# EAGLE design rub-20-datalogger-schaltplan (EAGLE 9.5.2)

## Sheet 1 of 6
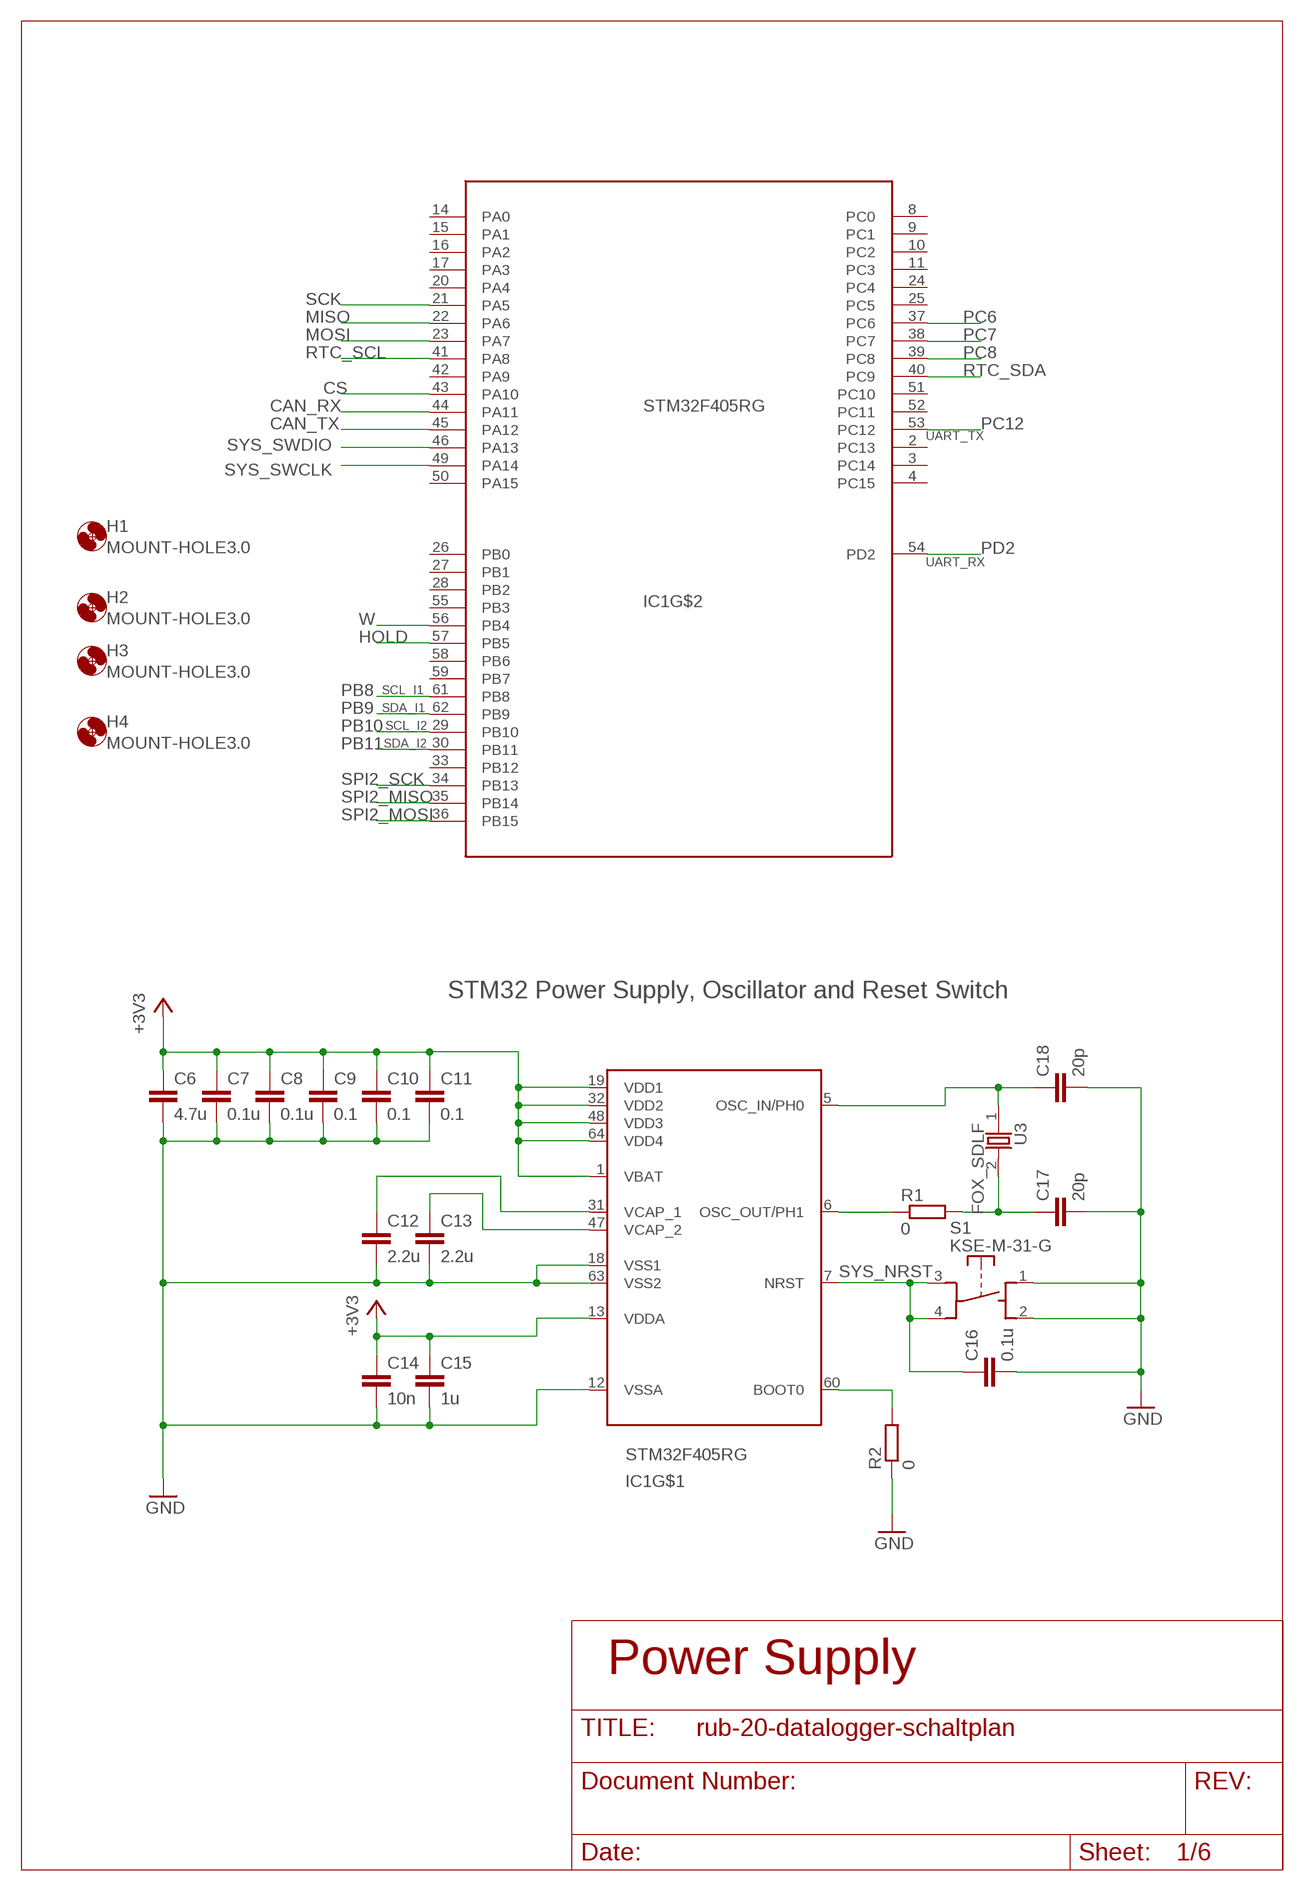
[diagram p0: schematic, sheet 1]

### Parts
C6  4.7u  C-EUC0805  [C0805]
C7  0.1u  C-EUC0805  [C0805]
C8  0.1u  C-EUC0805  [C0805]
C9  0.1  C-EUC0805  [C0805]
C10  0.1  C-EUC0805  [C0805]
C11  0.1  C-EUC0805  [C0805]
C12  2.2u  C-EUC0805  [C0805]
C13  2.2u  C-EUC0805  [C0805]
C14  10n  C-EUC0805  [C0805]
C15  1u  C-EUC0805  [C0805]
C16  0.1u  C-EUC0805  [C0805]
C17  20p  C-EUC0805  [C0805]
C18  20p  C-EUC0805  [C0805]
H1  MOUNT-HOLE3.0  [3,0]
H2  MOUNT-HOLE3.0  [3,0]
H3  MOUNT-HOLE3.0  [3,0]
H4  MOUNT-HOLE3.0  [3,0]
IC1  STM32F405RG  [LQFP64]
R1  0  R-EU_R0805  [R0805]
R2  0  R-EU_R0805  [R0805]
S1  KSE-M-31-G  [KSE-M-31-G]
U3  FOX_SDLF  [HC49SSDLF]

### Nets
+3V3: C6.1 C7.1 C8.1 C9.1 C10.1 C11.1 C14.1 C15.1 IC1.1(VBAT) IC1.13(VDDA) IC1.19(VDD1) IC1.32(VDD2) IC1.48(VDD3) IC1.64(VDD4) ; also sheet 2,3,4,5,6
CAN_RX: IC1.44(PA11) ; also sheet 2
CAN_TX: IC1.45(PA12) ; also sheet 2
CS: IC1.43(PA10) ; also sheet 5
GND: C6.2 C7.2 C8.2 C9.2 C10.2 C11.2 C12.2 C13.2 C14.2 C15.2 C16.2 C17.2 C18.2 IC1.12(VSSA) IC1.18(VSS1) IC1.63(VSS2) R2.1 S1.1 S1.2 ; also sheet 2,3,4,5,6
HOLD: IC1.57(PB5) ; also sheet 4
MISO: IC1.22(PA6) ; also sheet 5
MOSI: IC1.23(PA7) ; also sheet 5
N$1: C13.1 IC1.47(VCAP_2)
N$2: C12.1 IC1.31(VCAP_1)
N$3: IC1.60(BOOT0) R2.2
N$4: IC1.6(OSC_OUT/PH1) R1.1
N$5: C17.1 R1.2 U3.2
N$6: C18.1 IC1.5(OSC_IN/PH0) U3.1
PB8: IC1.61(PB8) ; also sheet 4
PB9: IC1.62(PB9) ; also sheet 4
PB10: IC1.29(PB10) ; also sheet 4
PB11: IC1.30(PB11) ; also sheet 4
PC6: IC1.37(PC6) ; also sheet 3
PC7: IC1.38(PC7) ; also sheet 3
PC8: IC1.39(PC8) ; also sheet 3
PC12: IC1.53(PC12) ; also sheet 3
PD2: IC1.54(PD2) ; also sheet 3
RTC_SCL: IC1.41(PA8) ; also sheet 6
RTC_SDA: IC1.40(PC9) ; also sheet 6
SCK: IC1.21(PA5) ; also sheet 5
SPI2_MISO: IC1.35(PB14) ; also sheet 4
SPI2_MOSI: IC1.36(PB15) ; also sheet 4
SPI2_SCK: IC1.34(PB13) ; also sheet 4
SYS_NRST: C16.1 IC1.7(NRST) S1.3 S1.4 ; also sheet 2
SYS_SWCLK: IC1.49(PA14) ; also sheet 2
SYS_SWDIO: IC1.46(PA13) ; also sheet 2
W: IC1.56(PB4) ; also sheet 4
Unconnected: IC1.2(PC13) IC1.3(PC14) IC1.4(PC15) IC1.8(PC0) IC1.9(PC1) IC1.10(PC2) IC1.11(PC3) IC1.14(PA0) IC1.15(PA1) IC1.16(PA2) IC1.17(PA3) IC1.20(PA4) IC1.24(PC4) IC1.25(PC5) IC1.26(PB0) IC1.27(PB1) IC1.28(PB2) IC1.33(PB12) IC1.42(PA9) IC1.50(PA15) IC1.51(PC10) IC1.52(PC11) IC1.55(PB3) IC1.58(PB6) IC1.59(PB7)

### Notes on the sheet
- UART_TX
- UART_RX
- SCL_I1
- SDA_I1
- SCL_I2
- SDA_I2
- STM32 Power Supply, Oscillator and Reset Switch
- Power Supply

## Sheet 2 of 6
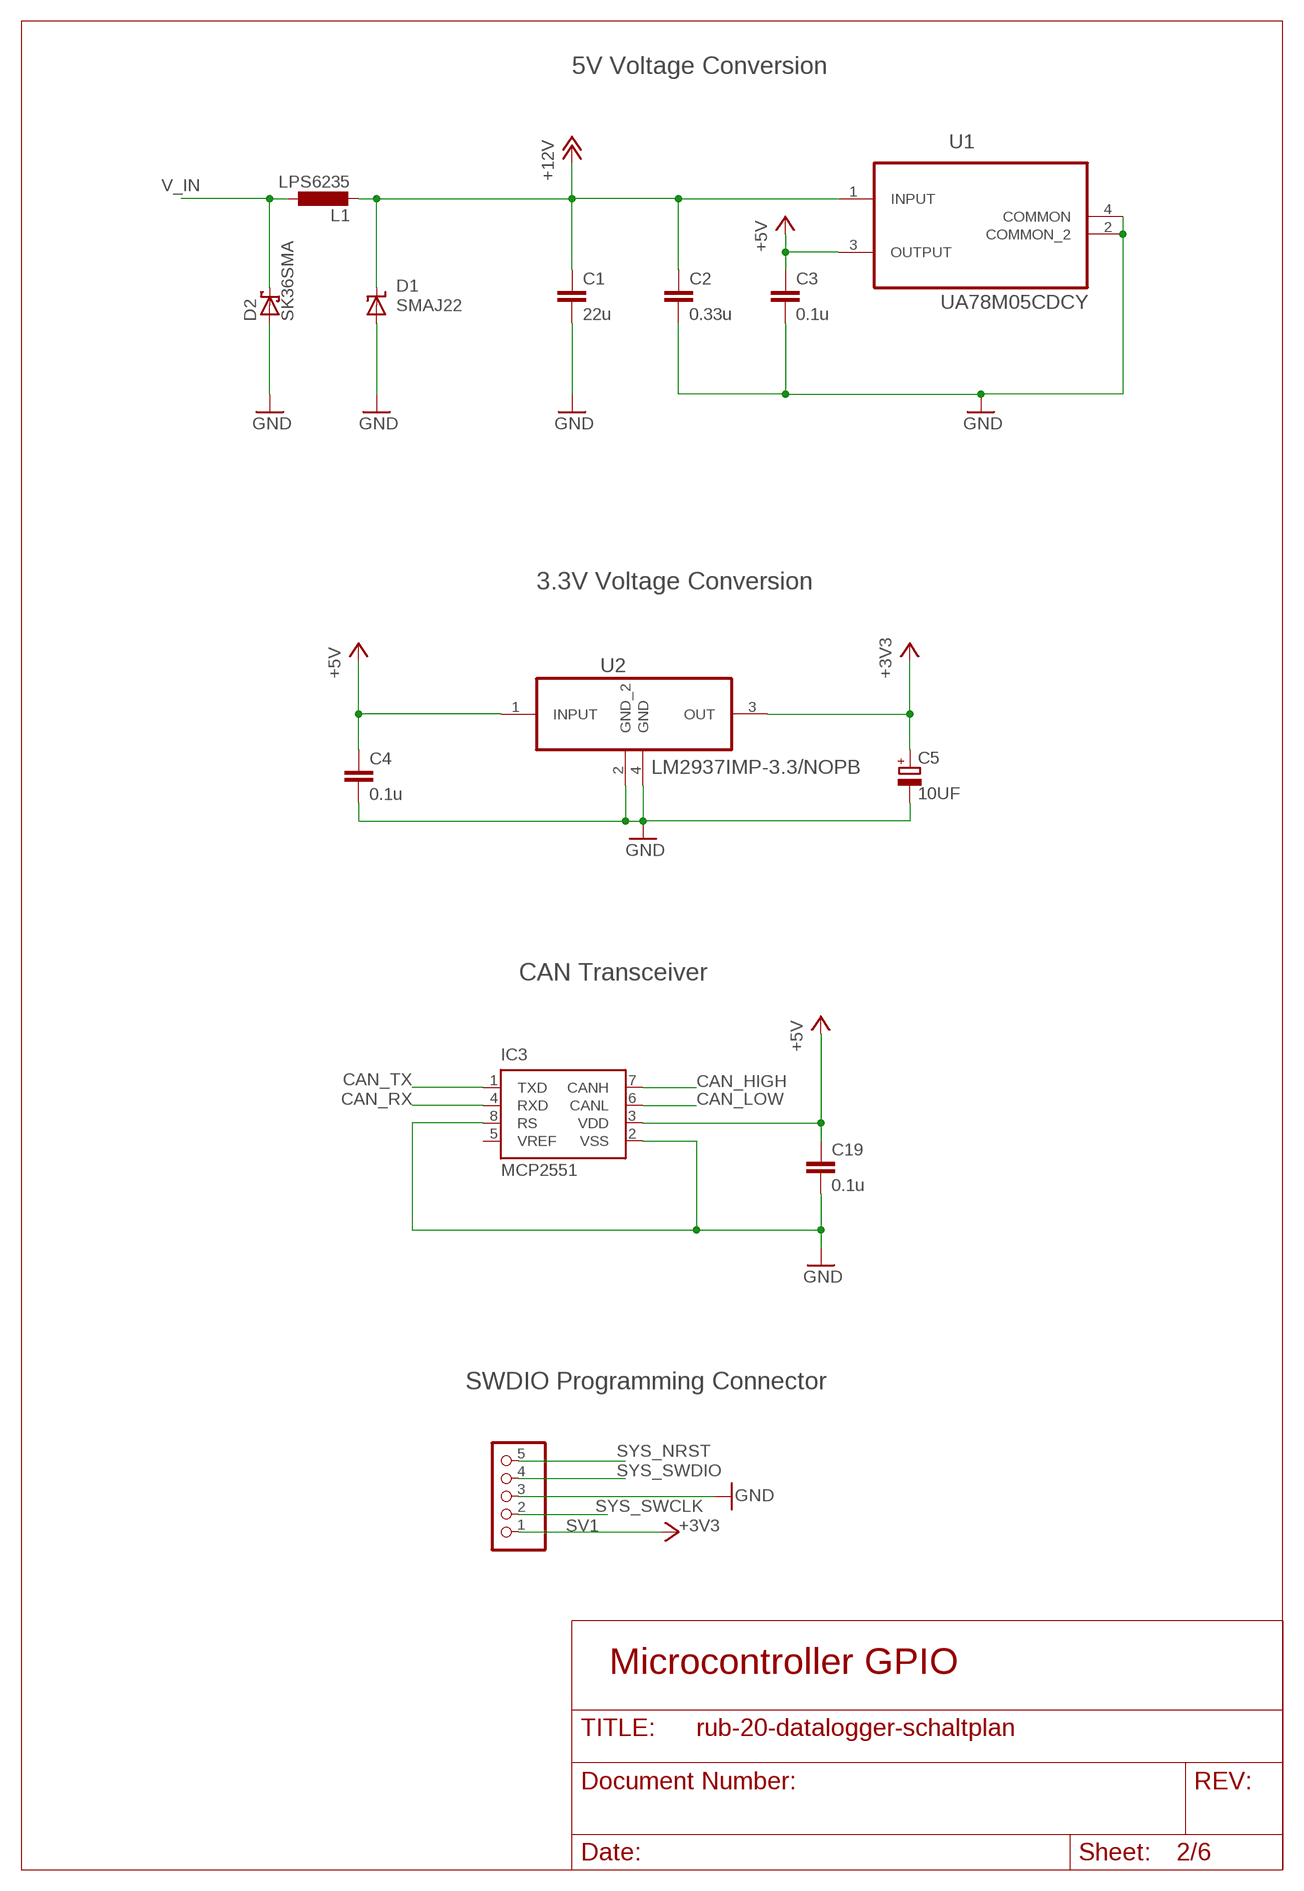
[diagram p1: schematic, sheet 2]

### Parts
C1  22u  C-EUC1812K  [C1812K]
C2  0.33u  C-EUC0805  [C0805]
C3  0.1u  C-EUC0805  [C0805]
C4  0.1u  C-EUC0805  [C0805]
C5  10UF  EEE-FK1C100AR-CASE-B  [CAPAE430X610N]
C19  0.1u  C-EUC0805  [C0805]
D1  SMAJ22  [SMA-DO214AC]
D2  SK36SMA  [DO214AC]
IC3  MCP2551  [8SO]
L1  LPS6235  [LPS6235]
SV1  PINHD-1X5  [1X05]
U1  UA78M05CDCY  [SOT230P700X180-4N]
U2  LM2937IMP-3.3/NOPB  [SOT230P700X180-4N]

### Nets
+3V3: C5.1(+) SV1.1 U2.3(OUT) ; also sheet 1,3,4,5,6
+5V: C3.1 C4.1 C19.1 IC3.3(VDD) U1.3(OUTPUT) U2.1(INPUT) ; also sheet 3,4
+12V: C1.1 C2.1 D1.K(C) L1.2 U1.1(INPUT) ; also sheet 3
CAN_HIGH: IC3.7(CANH) ; also sheet 3
CAN_LOW: IC3.6(CANL) ; also sheet 3
CAN_RX: IC3.4(RXD) ; also sheet 1
CAN_TX: IC3.1(TXD) ; also sheet 1
GND: C1.2 C2.2 C3.2 C4.2 C5.2(-) C19.2 D1.A D2.A IC3.2(VSS) IC3.8(RS) SV1.3 U1.2(COMMON_2) U1.4(COMMON) U2.2(GND_2) U2.4(GND) ; also sheet 1,3,4,5,6
SYS_NRST: SV1.5 ; also sheet 1
SYS_SWCLK: SV1.2 ; also sheet 1
SYS_SWDIO: SV1.4 ; also sheet 1
V_IN: D2.C L1.1 ; also sheet 3
Unconnected: IC3.5(VREF)

### Notes on the sheet
- 5V Voltage Conversion
- 3.3V Voltage Conversion
- CAN Transceiver
- SWDIO Programming Connector
- Microcontroller GPIO

## Sheet 3 of 6
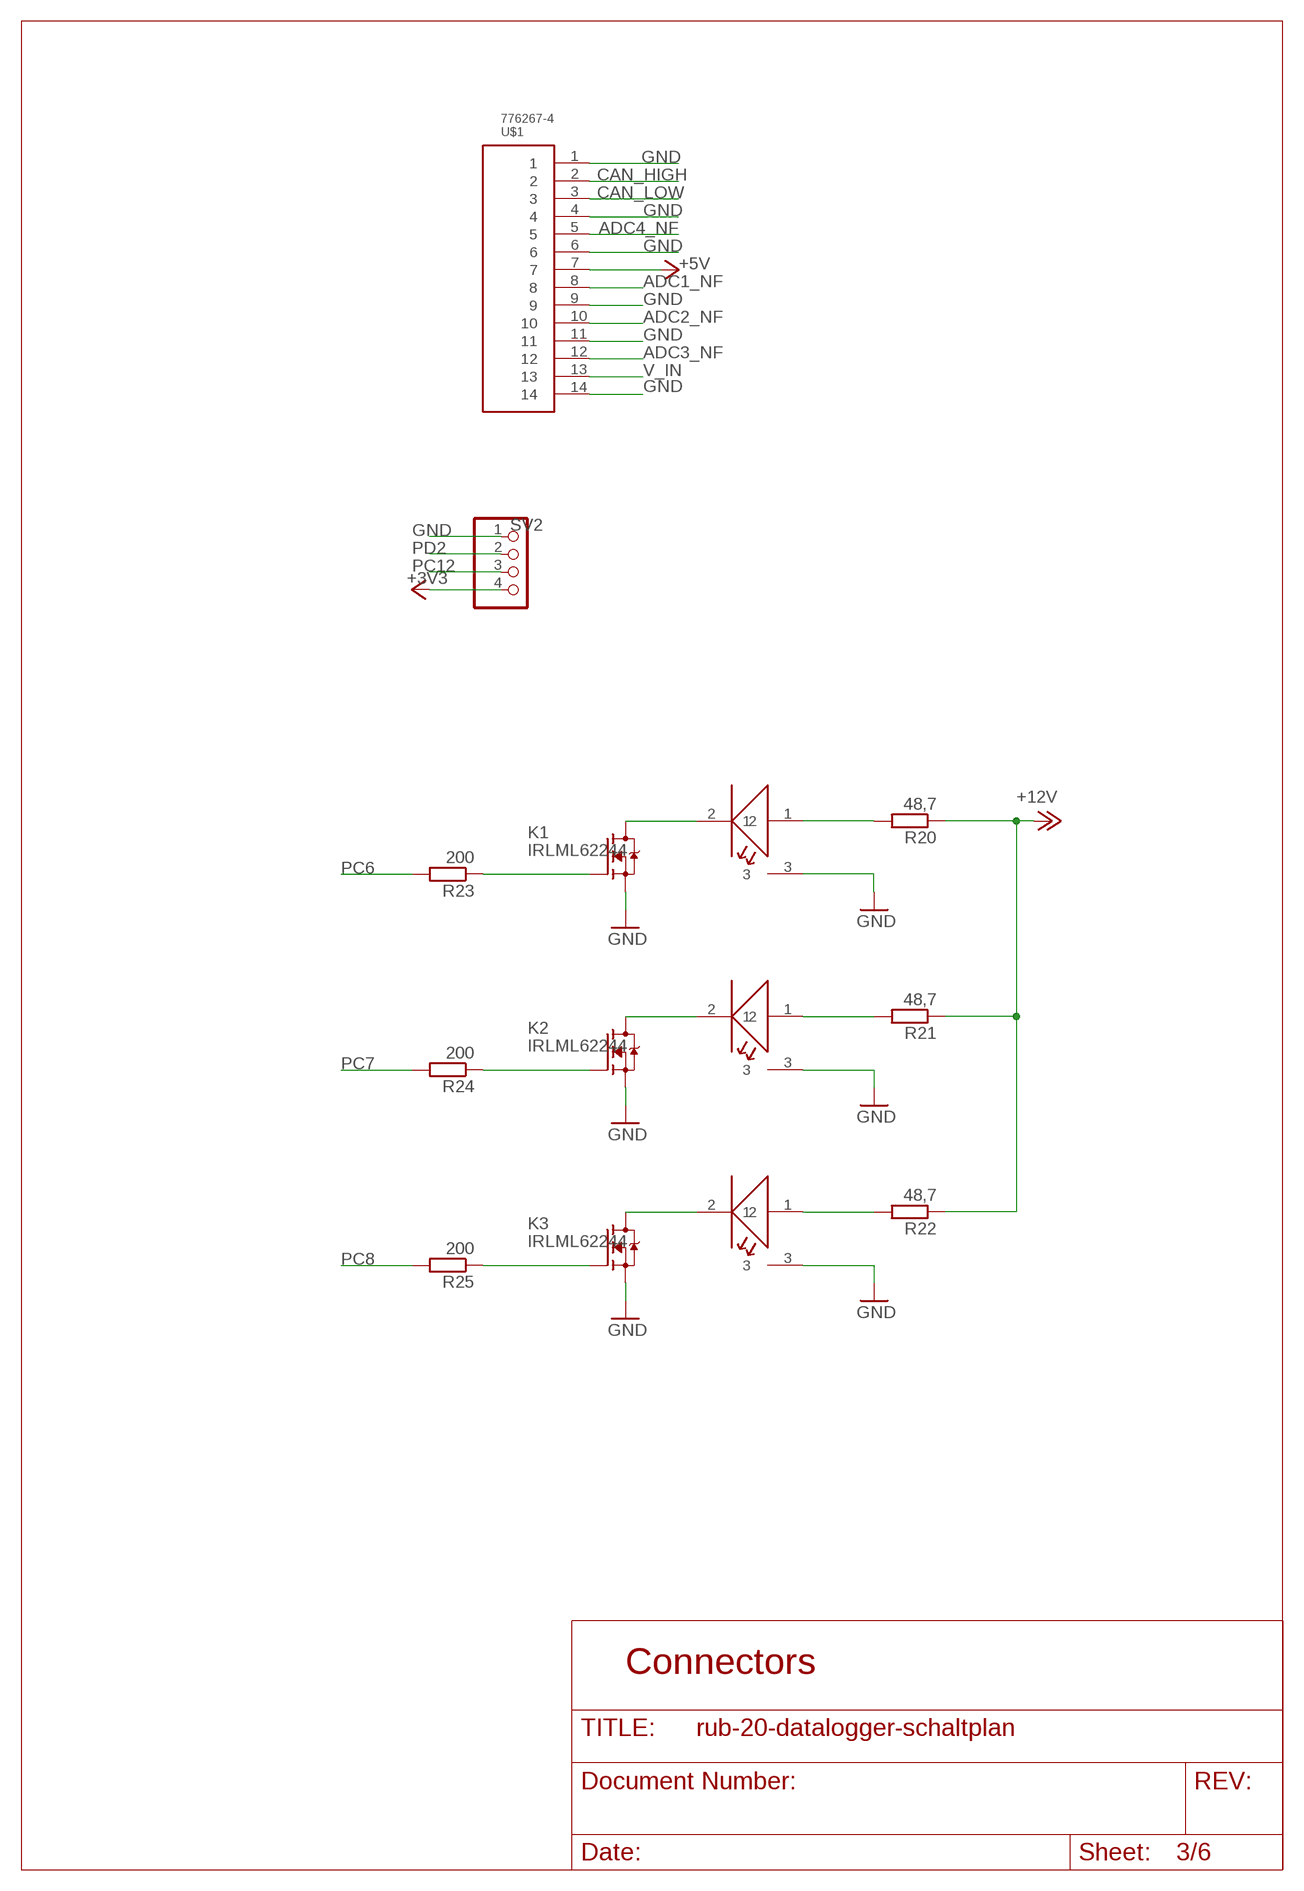
[diagram p2: schematic, sheet 3]

### Parts
K1  IRLML62244  [SOT23-MICRO]
K2  IRLML62244  [SOT23-MICRO]
K3  IRLML62244  [SOT23-MICRO]
P1  XLAMP_ML-E  [CREE_XLAMP_ML-E]
P2  XLAMP_ML-E  [CREE_XLAMP_ML-E]
P3  XLAMP_ML-E  [CREE_XLAMP_ML-E]
R20  48,7  R-EU_R0805  [R0805]
R21  48,7  R-EU_R0805  [R0805]
R22  48,7  R-EU_R0805  [R0805]
R23  200  R-EU_R0805  [R0805]
R24  200  R-EU_R0805  [R0805]
R25  200  R-EU_R0805  [R0805]
SV2  PINHD-1X4  [1X04]
U$1  776267-4  [TE_776267-4]

### Nets
+3V3: SV2.4 ; also sheet 1,2,4,5,6
+5V: U$1.7 ; also sheet 2,4
+12V: R20.1 R21.1 R22.1 ; also sheet 2
ADC1_NF: U$1.8 ; also sheet 4
ADC2_NF: U$1.10 ; also sheet 4
ADC3_NF: U$1.12 ; also sheet 4
ADC4_NF: U$1.5 ; also sheet 4
CAN_HIGH: U$1.2 ; also sheet 2
CAN_LOW: U$1.3 ; also sheet 2
GND: K1.2(S) K2.2(S) K3.2(S) P1.3 P2.3 P3.3 SV2.1 U$1.1 U$1.4 U$1.6 U$1.9 U$1.11 U$1.14 ; also sheet 1,2,4,5,6
N$22: P2.1 R21.2
N$23: P1.1 R20.2
N$24: P3.1 R22.2
N$28: K1.1(G) R23.1
N$29: K2.1(G) R24.1
N$30: K3.1(G) R25.1
N$31: K1.3(D) P1.2
N$32: K2.3(D) P2.2
N$33: K3.3(D) P3.2
PC6: R23.2 ; also sheet 1
PC7: R24.2 ; also sheet 1
PC8: R25.2 ; also sheet 1
PC12: SV2.3 ; also sheet 1
PD2: SV2.2 ; also sheet 1
V_IN: U$1.13 ; also sheet 2

### Notes on the sheet
- Connectors

## Sheet 4 of 6
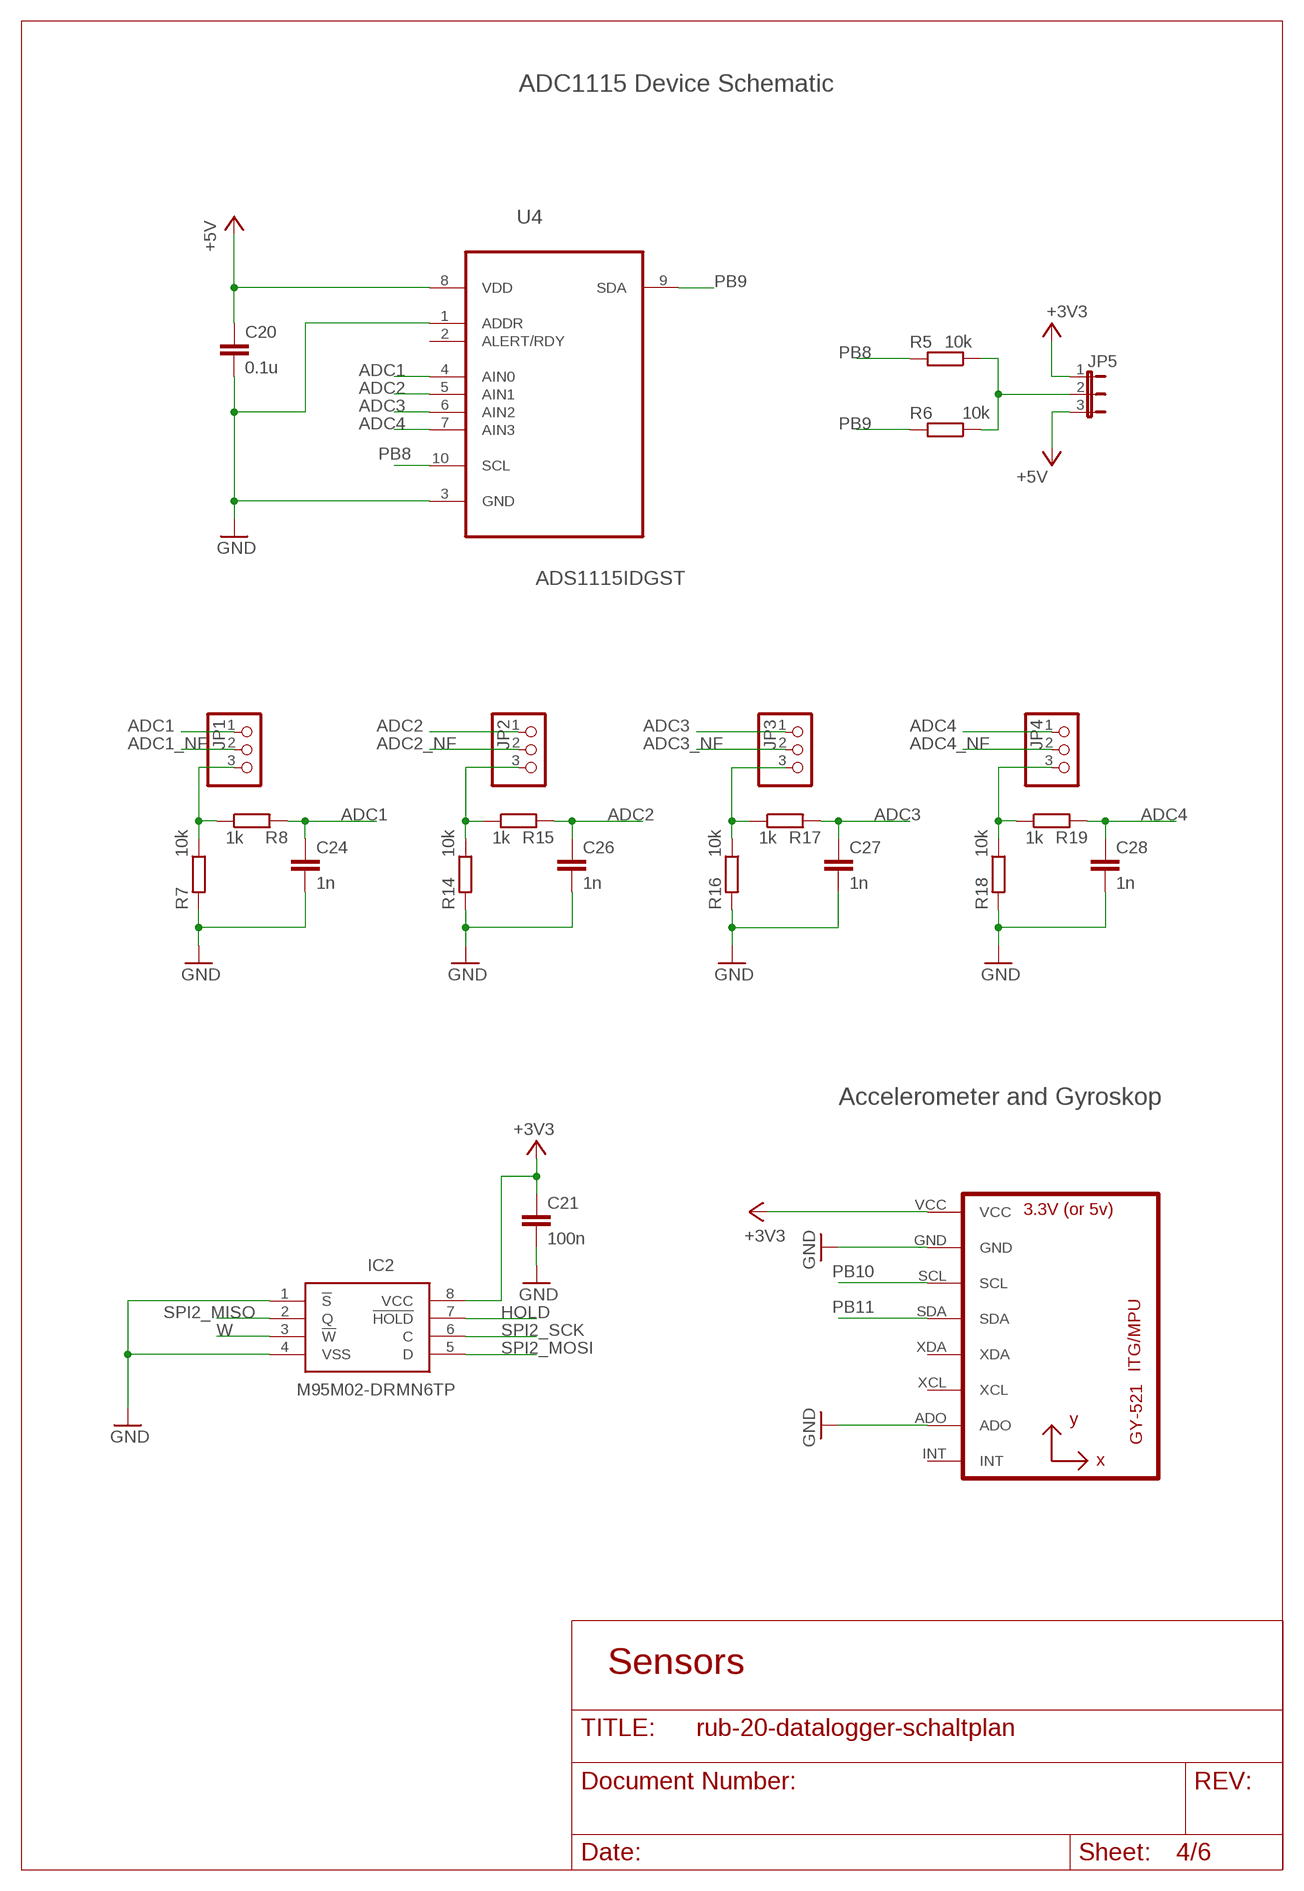
[diagram p3: schematic, sheet 4]

### Parts
C20  0.1u  C-EUC0805  [C0805]
C21  100n  C-EUC0805  [C0805]
C24  1n  C-EUC0805  [C0805]
C26  1n  C-EUC0805  [C0805]
C27  1n  C-EUC0805  [C0805]
C28  1n  C-EUC0805  [C0805]
IC2  M95M02-DRMN6TP  [SOIC127P600X175-8N]
JP1  PINHD-1X3  [1X03]
JP2  PINHD-1X3  [1X03]
JP3  PINHD-1X3  [1X03]
JP4  PINHD-1X3  [1X03]
JP5  JP2E  [JP2]
R5  10k  R-EU_R0805  [R0805]
R6  10k  R-EU_R0805  [R0805]
R7  10k  R-EU_R0805  [R0805]
R8  1k  R-EU_R0805  [R0805]
R14  10k  R-EU_R0805  [R0805]
R15  1k  R-EU_R0805  [R0805]
R16  10k  R-EU_R0805  [R0805]
R17  1k  R-EU_R0805  [R0805]
R18  10k  R-EU_R0805  [R0805]
R19  1k  R-EU_R0805  [R0805]
U4  ADS1115IDGST  [SOP50P490X110-10N]
U6  GY-521MPU6050  [GY-521]

### Nets
+3V3: C21.1 IC2.8(VCC) JP5.1 U6.VCC ; also sheet 1,2,3,5,6
+5V: C20.1 JP5.3 U4.8(VDD) ; also sheet 2,3
ADC1: C24.1 JP1.1 R8.2 U4.4(AIN0)
ADC1_NF: JP1.2 ; also sheet 3
ADC2: C26.1 JP2.1 R15.2 U4.5(AIN1)
ADC2_NF: JP2.2 ; also sheet 3
ADC3: C27.1 JP3.1 R17.2 U4.6(AIN2)
ADC3_NF: JP3.2 ; also sheet 3
ADC4: C28.1 JP4.1 R19.2 U4.7(AIN3)
ADC4_NF: JP4.2 ; also sheet 3
GND: C20.2 C21.2 C24.2 C26.2 C27.2 C28.2 IC2.1(!S) IC2.4(VSS) R7.2 R14.2 R16.2 R18.2 U4.1(ADDR) U4.3(GND) U6.ADO U6.GND ; also sheet 1,2,3,5,6
HOLD: IC2.7(!HOLD) ; also sheet 1
N$17: JP1.3 R7.1 R8.1
N$18: JP2.3 R14.1 R15.1
N$19: JP3.3 R16.1 R17.1
N$20: JP4.3 R18.1 R19.1
N$21: JP5.2 R5.1 R6.1
PB8: R5.2 U4.10(SCL) ; also sheet 1
PB9: R6.2 U4.9(SDA) ; also sheet 1
PB10: U6.SCL ; also sheet 1
PB11: U6.SDA ; also sheet 1
SPI2_MISO: IC2.2(Q) ; also sheet 1
SPI2_MOSI: IC2.5(D) ; also sheet 1
SPI2_SCK: IC2.6(C) ; also sheet 1
W: IC2.3(!W) ; also sheet 1
Unconnected: U4.2(ALERT/RDY) U6.INT U6.XCL U6.XDA

### Notes on the sheet
- ADC1115 Device Schematic
- Accelerometer and Gyroskop
- Sensors

## Sheet 5 of 6
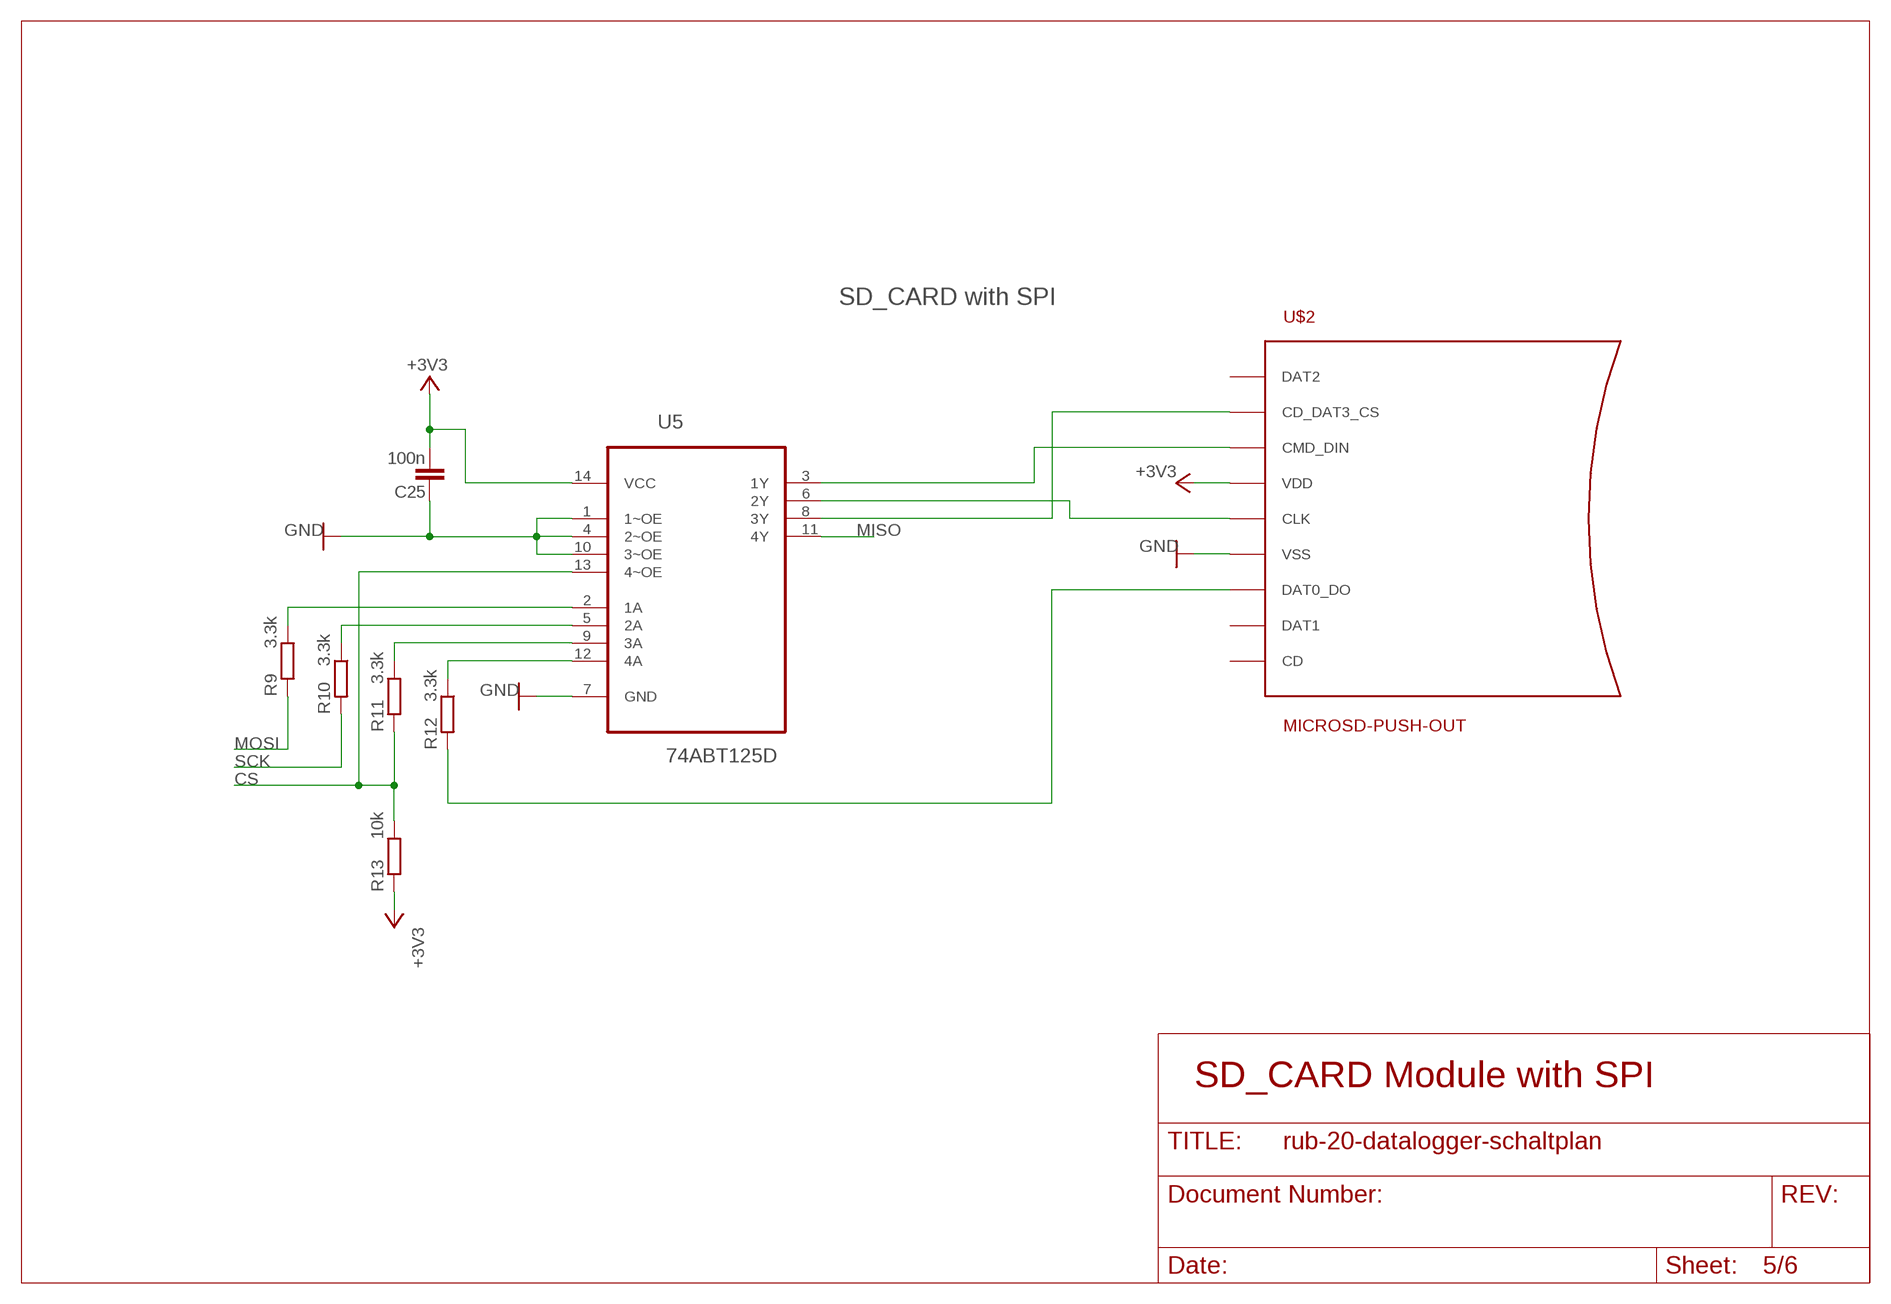
[diagram p4: schematic, sheet 5]

### Parts
C25  100n  C-EUC0805  [C0805]
R9  3.3k  R-EU_R0805  [R0805]
R10  3.3k  R-EU_R0805  [R0805]
R11  3.3k  R-EU_R0805  [R0805]
R12  3.3k  R-EU_R0805  [R0805]
R13  10k  R-EU_R0805  [R0805]
U5  74ABT125D  [SOIC127P600X175-14N]
U$2  MICROSD-PUSH-OUT  [MICROSD-PUSH-OUT]

### Nets
+3V3: C25.2 R13.2 U5.14(VCC) U$2.4(VDD) ; also sheet 1,2,3,4,6
CS: R11.2 R13.1 U5.13(4~OE) ; also sheet 1
GND: C25.1 U5.1(1~OE) U5.4(2~OE) U5.7(GND) U5.10(3~OE) U$2.6(VSS) U$2.G1(VSS) U$2.G2(VSS) U$2.G3(VSS) U$2.G4(VSS) ; also sheet 1,2,3,4,6
MISO: U5.11(4Y) ; also sheet 1
MOSI: R9.2 ; also sheet 1
N$7: R9.1 U5.2(1A)
N$9: U5.8(3Y) U$2.2(CD_DAT3_CS)
N$11: U5.3(1Y) U$2.3(CMD_DIN)
N$12: U5.6(2Y) U$2.5(CLK)
N$13: R12.1 U5.12(4A)
N$14: R10.1 U5.5(2A)
N$15: R11.1 U5.9(3A)
N$16: R12.2 U$2.7(DAT0_DO)
SCK: R10.2 ; also sheet 1
Unconnected: U$2.1(DAT2) U$2.8(DAT1) U$2.CD

### Notes on the sheet
- SD_CARD with SPI
- SD_CARD Module with SPI

## Sheet 6 of 6
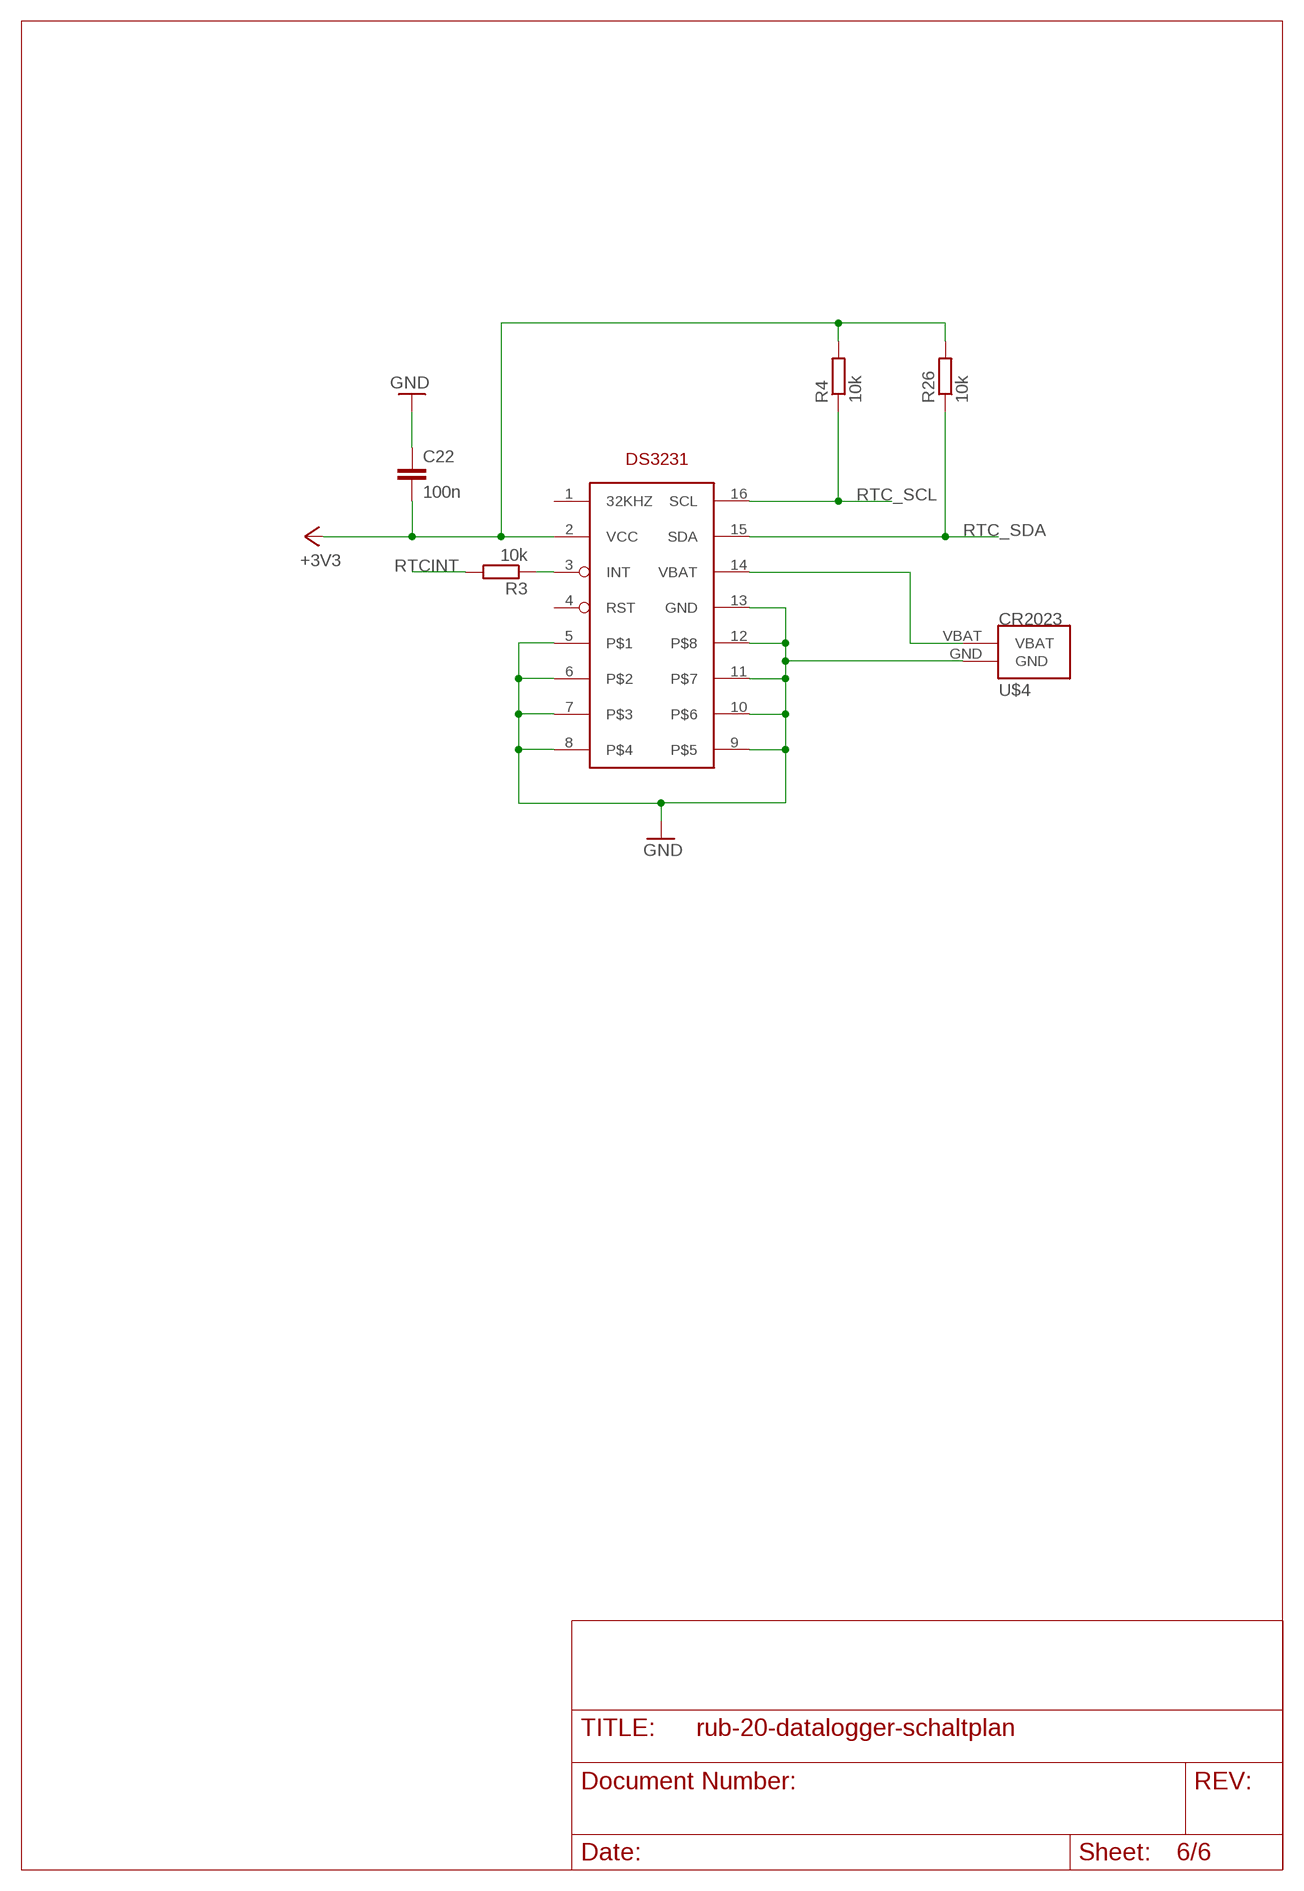
[diagram p5: schematic, sheet 6]

### Parts
C22  100n  C-EUC0805  [C0805]
R3  10k  R-EU_R0805  [R0805]
R4  10k  R-EU_R0805  [R0805]
R26  10k  R-EU_R0805  [R0805]
U$3  DS3231  [SO16]
U$4  CR2023  [STMU2023-G]

### Nets
+3V3: C22.2 R4.2 R26.2 U$3.2(VCC) ; also sheet 1,2,3,4,5
GND: C22.1 U$3.5 U$3.6 U$3.7 U$3.8 U$3.9 U$3.10 U$3.11 U$3.12 U$3.13(GND) U$4.GND ; also sheet 1,2,3,4,5
N$8: U$3.14(VBAT) U$4.VBAT
N$25: R3.1 U$3.3(INT)
RTC_SCL: R4.1 U$3.16(SCL) ; also sheet 1
RTC_SDA: R26.1 U$3.15(SDA) ; also sheet 1
RTCINT: R3.2
Unconnected: U$3.1(32KHZ) U$3.4(RST)

## Library data of the parts
C1-C4 C6-C22 C24-C28 = rcl:C-EU: CAPACITOR, European symbol; SPICEPREFIX: C
C5 = Panasonic-EEEFK_EEEFP:EEE-: Aluminum Electrolytic Capacitors,Surface Mount Type; MPN: EEE-FK1C100AR; OC_FARNELL: 2254388; OC_NEWARK: 54W2510; PACKAGE: CASE-B; SUPPLIER: PANASONIC; TOLERANCE: �20 %; VOLTAGERATING: 16V
D1 = RUBM_PARTS:SMAJ22: The SMAJ22A from Taiwan Semiconductor is a SMAJ series unidirectional surface mount transient voltage suppressor in DO-214AC package. It has low profile package, excellent clamping capability and glass passivated junction. This transient voltage suppressor is ideal for automated placement. The leads are matte tin plated and solderable per JESD22-B102. It also meets JESD 201 class 2 whisker test.
D2 = RUBM_PARTS:SK36SMA
H1-H4 = holes:MOUNT-HOLE: MOUNTING HOLE with drill center marker
IC1 = RUBM_PARTS:STM32F405RG
IC2 = SamacSys_Parts:M95M02-DRMN6TP: 2-Mbit serial SPI bus EEPROM Source: Datasheet <https://componentsearchengine.com/Datasheets/1/M95M02-DRMN6TP.pdf>; DESCRIPTION: 2-Mbit serial SPI bus EEPROM; HEIGHT: 1.75mm; MANUFACTURER_NAME: STMicroelectronics; MANUFACTURER_PART_NUMBER: M95M02-DRMN6TP; MOUSER_PART_NUMBER: 511-M95M02-DRMN6TP; MOUSER_PRICE-STOCK: https://www.mouser.com/Search/Refine.aspx?Keyword=511-M95M02-DRMN6TP
IC3 = RUBM_PARTS:MCP2551
JP1-JP4 = pinhead:PINHD-1X3: PIN HEADER
JP5 = jumper:JP2E: JUMPER
K1-K3 = RUBM_PARTS:IRLML62244
L1 = RUBM_PARTS:LPS6235
P1-P3 = RUBM_PARTS:XLAMP_ML-E
R1-R26 = rcl:R-EU_: RESISTOR, European symbol; SPICEPREFIX: R
S1 = RUBM_PARTS:KSE-M-31-G
SV1 = pinhead:PINHD-1X5: PIN HEADER
SV2 = pinhead:PINHD-1X4: PIN HEADER
U1 = RUBM_PARTS:UA78M05CDCY: IC, LINEAR VOLT REGULATOR, 5V; MPN: UA78M05CDCY; OC_FARNELL: 2296030; OC_NEWARK: 77C1885; PACKAGE: SOT-223-3; SUPPLIER: TEXAS INSTRUMENTS
U2 = RUBM_PARTS:LM2937IMP-3.3/NOPB: LDO,3.3V 400mA and 500mA Voltage Regulators, SOT223-3; MPN: LM2937IMP-3.3/NOPB; OC_FARNELL: 2296021; OC_NEWARK: 28K1907; PACKAGE: SOT223-3; SUPPLIER: TEXAS INSTRUMENTS
U3 = RUBM_PARTS:FOX_SDLF
U4 = Texas Instruments_By_element14_Batch_1:ADS1115IDGST: Analog-to-Digital Converter with Internal Reference; MPN: ADS1115IDGST; OC_FARNELL: 1762981; OC_NEWARK: 25R1241; PACKAGE: MSOP-10; SUPPLIER: Texas Instruments
U5 = NXP_By_element14_Batch_1:74ABT125D: Quad buffer; MPN: 74ABT125D; OC_FARNELL: 1085352; OC_NEWARK: 99K0467; PACKAGE: SOIC-14; SUPPLIER: NXP
U6 = gy-521_holes:GY-521
U$1 = 776267-4:776267-4: 14 POS RTANG HDR ASSY W/GASKET; AVAILABILITY: Unavailable; COMMENT: 776267-4; DESCRIPTION: Conn Shrouded Header HDR 14 POS 4mm Solder RA Thru-Hole Automotive; EU_ROHS_COMPLIANCE: Compliant; MF: TE Connectivity; MP: 776267-4; PACKAGE: None; PRICE: None; TE_PURCHASE_URL: https://www.te.com/usa-en/product-776267-4.html?te_bu=Cor&te_type=disp&te_campaign=seda_glo_cor-seda-global-disp-prtnr-fy19-seda-model-bom-cta_sma-317_1&elqCampaignId=32493
U$2 = microsd:MICROSD-PUSH-OUT: T-Flash Push-Out Micro SD Card Reader 14.75mm x 14.5mm SMD with external pins
U$3 = DS3231_new:DS3231
U$4 = cr2023:CR2023: CR2023 Retainer with SMTU2023-G package

## Board
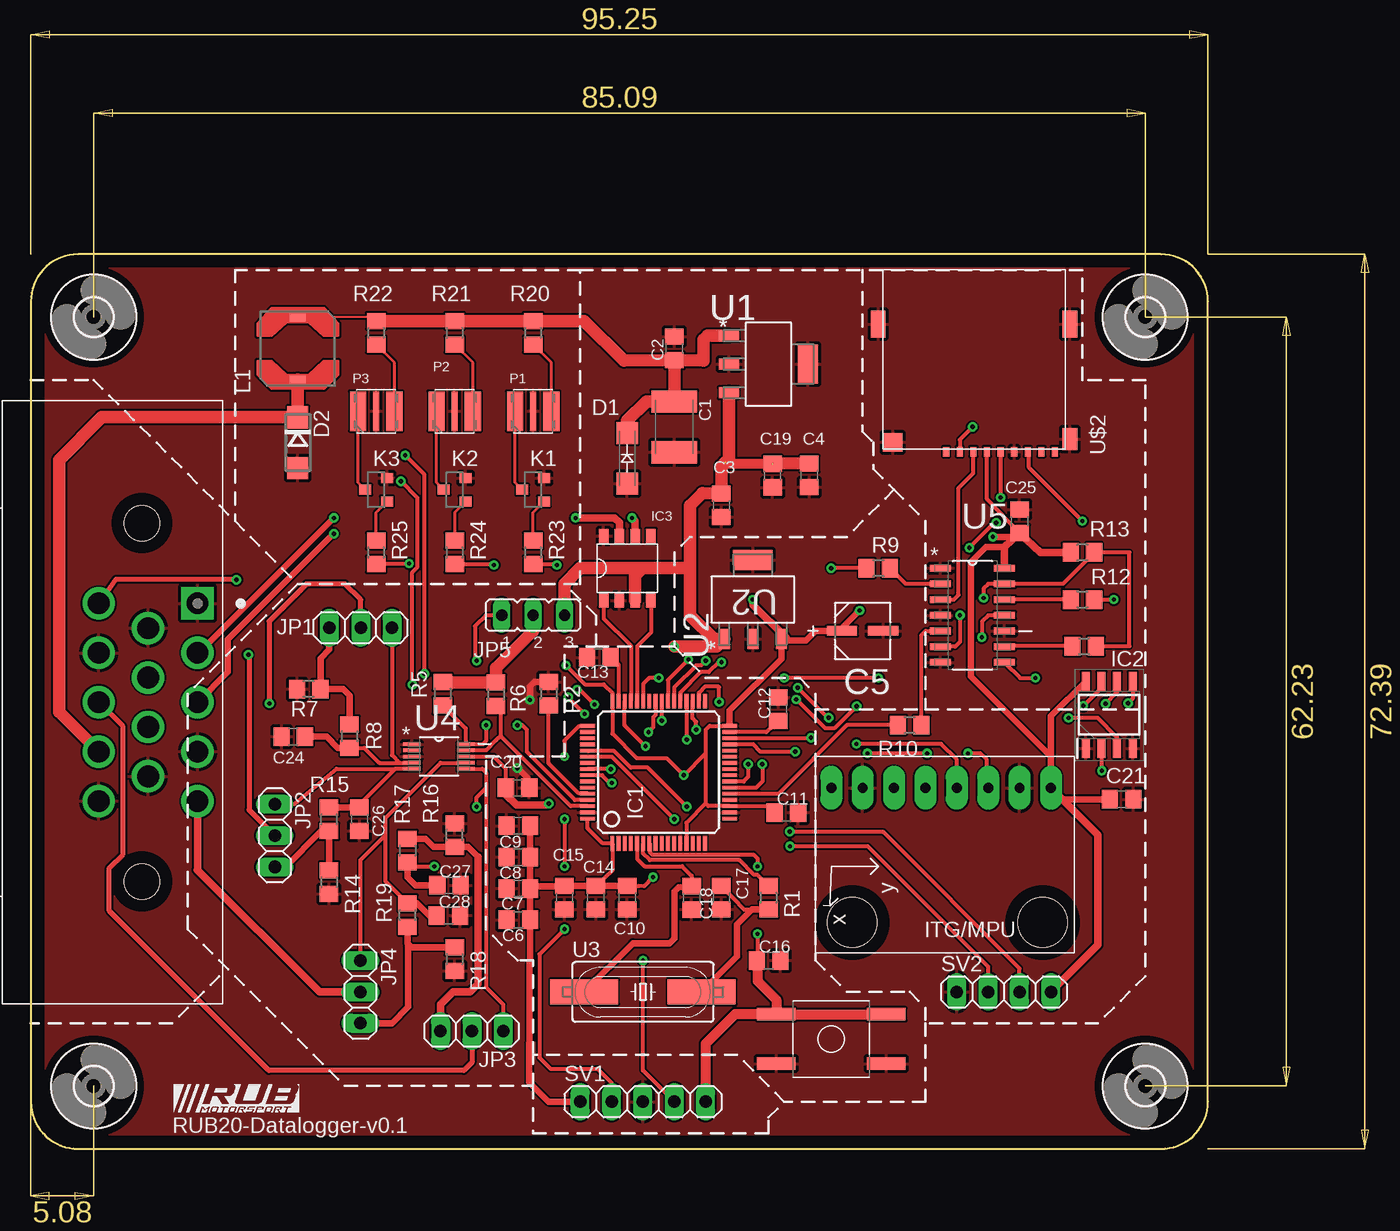
[diagram p6: board, top side]
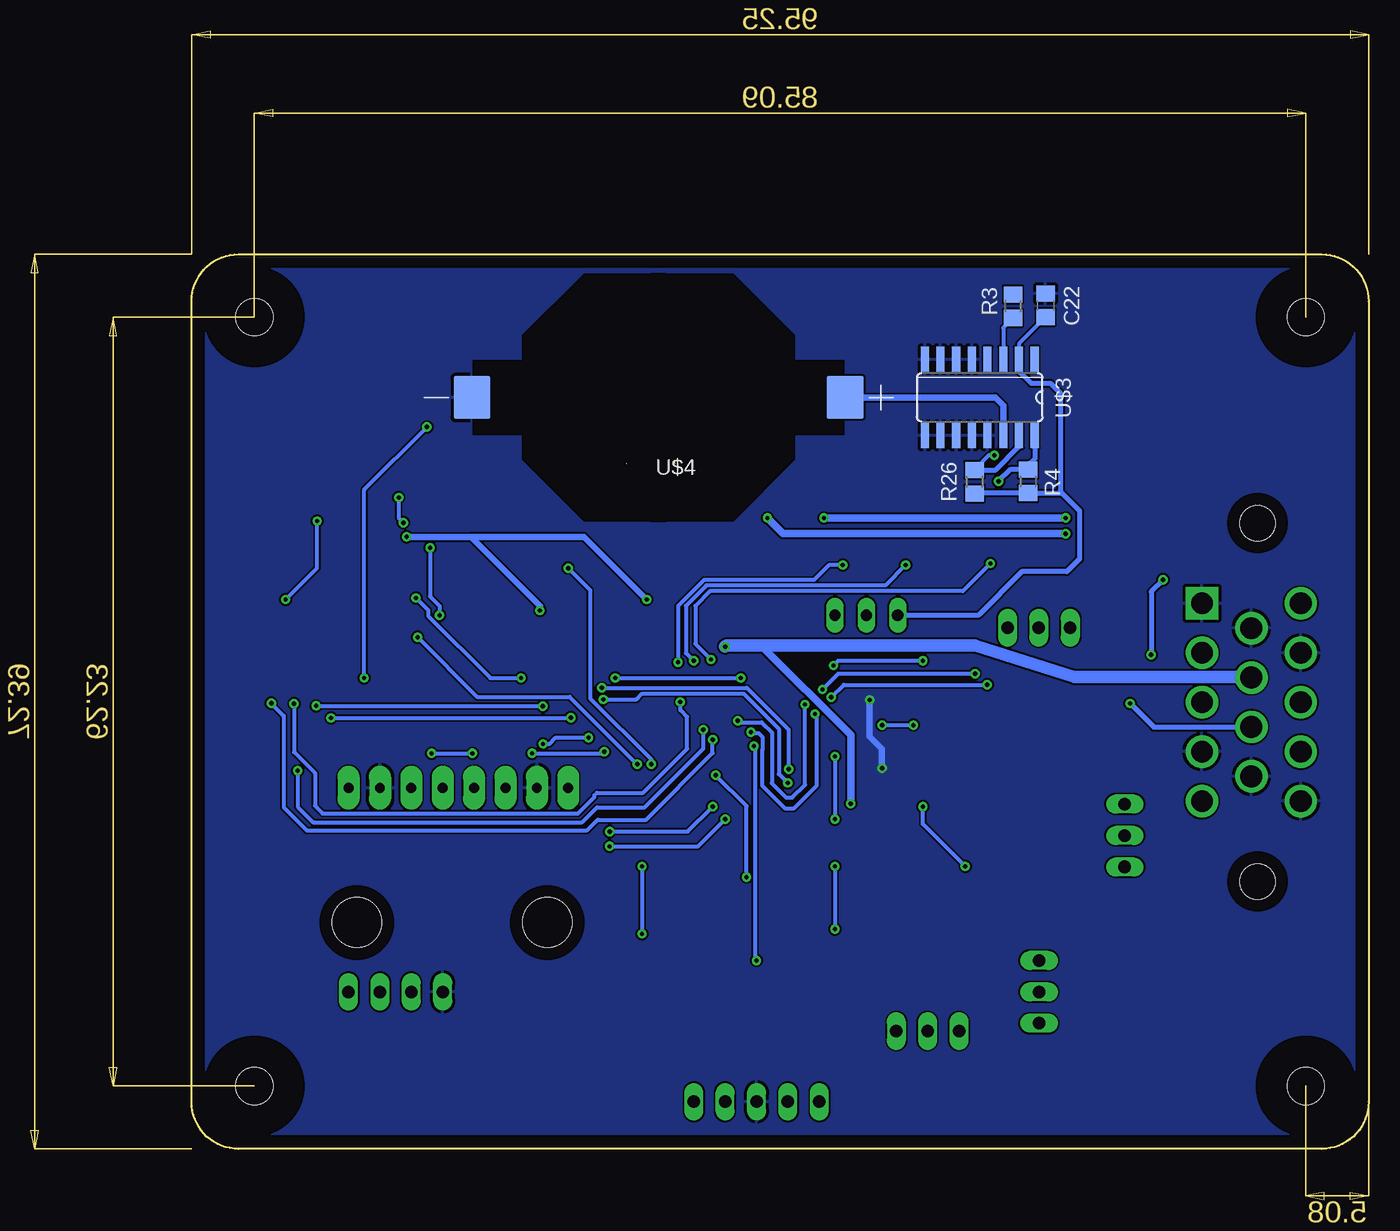
[diagram p7: board, bottom side, seen from below]

Size 95.25 x 72.39 mm. Coordinates in mm from the lower left corner, seen from the top.
Outline: 0,68.58 0,3.81 arc90 3.81,0 91.44,0 arc90 95.25,3.81 95.25,68.58 arc90 91.44,72.39 3.81,72.39 arc90 0,68.58
Copper layers (1*16): Top 0.035mm / dielectric 1.5mm / Bottom 0.035mm
Design rules "default": minimum track width 6mil, minimum drill 0.35mm, track to track 6mil, track to pad 6mil, pad to pad 6mil, via to via 6mil, smd to smd 6mil, copper to edge 40mil, drill to drill 6mil, minimum pad ring 10mil, minimum via ring 8mil, stop-mask expansion 4mil, vias tented up to drill 0mil, thermal gap 10mil

### Footprints (pad centres in the part's own frame; a part is rotated, then mirrored left to right if it is on the bottom)
C1812K = smd 1.8 x 3.7: 1 -2.05,0; 2 2.05,0
C0805 = smd 1.3 x 1.5: 1 -0.95,0; 2 0.95,0
CAPAE430X610N = smd 2.464 x 0.762: 1 -1.676,0; 2 1.676,0
SMA-DO214AC = smd 1.8 x 1.7: A -2.05,0; K 2.05,0
DO214AC = smd 1.8 x 1.7: A 2.05,0; C -2.05,0
3,0 = hole 3: 0,0
LQFP64 = smd 1.2 x 0.3: 1 -5.75,3.75; 2 -5.75,3.25; 3 -5.75,2.75; 4 -5.75,2.25; 5 -5.75,1.75; 6 -5.75,1.25; 7 -5.75,0.75; 8 -5.75,0.25; 9 -5.75,-0.25; 10 -5.75,-0.75; 11 -5.75,-1.25; 12 -5.75,-1.75; 13 -5.75,-2.25; 14 -5.75,-2.75; 15 -5.75,-3.25; 16 -5.75,-3.75; 33 5.75,-3.75; 34 5.75,-3.25; 35 5.75,-2.75; 36 5.75,-2.25; 37 5.75,-1.75; 38 5.75,-1.25; 39 5.75,-0.75; 40 5.75,-0.25; 41 5.75,0.25; 42 5.75,0.75; 43 5.75,1.25; 44 5.75,1.75; 45 5.75,2.25; 46 5.75,2.75; 47 5.75,3.25; 48 5.75,3.75 | smd 0.3 x 1.2: 17 -3.75,-5.75; 18 -3.25,-5.75; 19 -2.75,-5.75; 20 -2.25,-5.75; 21 -1.75,-5.75; 22 -1.25,-5.75; 23 -0.75,-5.75; 24 -0.25,-5.75; 25 0.25,-5.75; 26 0.75,-5.75; 27 1.25,-5.75; 28 1.75,-5.75; 29 2.25,-5.75; 30 2.75,-5.75; 31 3.25,-5.75; 32 3.75,-5.75; 49 3.75,5.75; 50 3.25,5.75; 51 2.75,5.75; 52 2.25,5.75; 53 1.75,5.75; 54 1.25,5.75; 55 0.75,5.75; 56 0.25,5.75; 57 -0.25,5.75; 58 -0.75,5.75; 59 -1.25,5.75; 60 -1.75,5.75; 61 -2.25,5.75; 62 -2.75,5.75; 63 -3.25,5.75; 64 -3.75,5.75
SOIC127P600X175-8N = smd 1.525 x 0.65: 1 -2.712,1.905; 2 -2.712,0.635; 3 -2.712,-0.635; 4 -2.712,-1.905; 5 2.712,-1.905; 6 2.712,-0.635; 7 2.712,0.635; 8 2.712,1.905
8SO = smd 0.762 x 1.143: 1 -1.905,-2.603; 2 -0.635,-2.603; 3 0.635,-2.603; 4 1.905,-2.603; 5 1.905,2.603; 6 0.635,2.603; 7 -0.635,2.603; 8 -1.905,2.603
1X03 = drill 1.016 long: 1 -2.54,0; 2 0,0; 3 2.54,0
JP2 = drill 0.914 long: 1 -2.54,0; 2 0,0; 3 2.54,0
SOT23-MICRO = smd 0.802 x 0.972: 1 -0.95,-0.885; 2 0.95,-0.885; 3 0,0.885
LPS6235 = smd 0.635 x 1.27: 1 -2.5,0; 2 2.5,0
CREE_XLAMP_ML-E = smd 1.3 x 3.2: 1 -1.475,0; 2 1.475,0 | smd 0.5 x 3.2: 3 0,0
R0805 = smd 1.3 x 1.5: 1 -0.95,0; 2 0.95,0
KSE-M-31-G = smd 3.1 x 1: 1 -4.45,2; 2 4.45,2; 3 -4.45,-2; 4 4.45,-2
1X05 = drill 1.016 long: 1 -5.08,0; 2 -2.54,0; 3 0,0; 4 2.54,0; 5 5.08,0
1X04 = drill 1.016 long: 1 -3.81,0; 2 -1.27,0; 3 1.27,0; 4 3.81,0
SOT230P700X180-4N = smd 1.626 x 0.889: 1 -3.2,2.311; 2 -3.2,0; 3 -3.2,-2.311 | smd 1.626 x 3.175: 4 3.2,0
HC49SSDLF = smd 5.5 x 2: 1 -4.75,0; 2 4.75,0
SOP50P490X110-10N = smd 1.422 x 0.279: 1 -2.184,0.991; 2 -2.184,0.508; 3 -2.184,0; 4 -2.184,-0.508; 5 -2.184,-0.991; 6 2.184,-0.991; 7 2.184,-0.508; 8 2.184,0; 9 2.184,0.508; 10 2.184,0.991
SOIC127P600X175-14N = smd 1.702 x 0.533: 1 -2.591,3.81; 2 -2.591,2.54; 3 -2.591,1.27; 4 -2.591,0; 5 -2.591,-1.27; 6 -2.591,-2.54; 7 -2.591,-3.81; 8 2.591,-3.81; 9 2.591,-2.54; 10 2.591,-1.27; 11 2.591,0; 12 2.591,1.27; 13 2.591,2.54; 14 2.591,3.81
GY-521 = drill 0.8 pad 1.778 long: ADO -8.89,-6.35; GND -8.89,6.35; INT -8.89,-8.89; SCL -8.89,3.81; SDA -8.89,1.27; VCC -8.89,8.89; XCL -8.89,-3.81; XDA -8.89,-1.27 | hole 4: 2,8.2; 2,-7.2
TE_776267-4 = drill 1.75 square: 1 0,0 | drill 1.75: 2 4,0; 3 8,0; 4 12,0; 5 16,0; 6 2,-4; 7 6,-4; 8 10,-4; 9 14,-4; 10 0,-8; 11 4,-8; 12 8,-8; 13 12,-8; 14 16,-8 | hole 2.85: -6.5,-4.5; 22.5,-4.5
MICROSD-PUSH-OUT = smd 0.5 x 0.75: 1 9.625,0.225; 2 8.525,0.225; 3 7.425,0.225; 4 6.325,0.225; 5 5.225,0.225; 6 4.125,0.225; 7 3.025,0.225; 8 1.925,0.225; CD 0.825,0.225 | smd 1.2 x 1.8: G1 -0.375,-0.8 | smd 1.2 x 2.2: G2 -0.375,-10.1; G4 15.125,-10.1 | smd 1.6 x 1.5: G3 13.95,-0.55
SO16 = smd 0.66 x 2.032: 1 -4.445,-3.073; 2 -3.175,-3.073; 3 -1.905,-3.073; 4 -0.635,-3.073; 5 0.635,-3.073; 6 1.905,-3.073; 7 3.175,-3.073; 8 4.445,-3.073; 9 4.445,3.073; 10 3.175,3.073; 11 1.905,3.073; 12 0.635,3.073; 13 -0.635,3.073; 14 -1.905,3.073; 15 -3.175,3.073; 16 -4.445,3.073
STMU2023-G = smd 3 x 3.5: GND 15.1,0; VBAT -15.1,0

### Placement (x,y rotation side)
C1  52.07,58.42 270 top
C2  52.07,64.77 90 top
C3  55.88,52.07 270 top
C4  62.99,54.5 270 top
C5  67.31,41.91 0 top
C6  39.45,18.53 180 top
C7  39.45,21.07 180 top
C8  39.45,23.61 180 top
C9  39.45,26.15 180 top
C10  48.26,20.32 270 top
C11  61.14,27.21 0 top
C12  60.48,35.58 90 top
C13  45.94,39.77 180 top
C14  45.72,20.32 270 top
C15  43.18,20.32 270 top
C16  59.69,15.24 0 top
C17  55.88,20.32 270 top
C18  53.47,20.31 270 top
C19  60.02,54.48 270 top
C20  39.38,29.21 0 top
C21  88.27,28.29 0 top
C22  26.14,68.26 270 bottom
C24  21.22,33.36 180 top
C25  80.01,50.8 270 top
C26  26.6,26.67 270 top
C27  33.84,21.33 0 top
C28  33.79,18.88 0 top
D1  48.26,55.88 90 top
D2  21.59,57.15 270 top
H1  90.17,67.31 0 top
H2  90.17,5.08 0 top
H3  5.08,67.31 0 top
H4  5.08,5.08 0 top
IC1  50.8,30.48 90 top
IC2  87.26,35.12 90 top
IC3  48.26,46.99 0 top
JP1  26.69,42.18 180 top
JP2  19.73,25.35 270 top
JP3  35.69,9.52 180 top
JP4  26.67,12.7 270 top
JP5  40.64,43.18 0 top
K1  40.64,53.34 90 top
K2  34.29,53.34 90 top
K3  27.94,53.34 90 top
L1  21.59,64.77 90 top
P1  40.64,59.69 180 top
P2  34.29,59.69 180 top
P3  27.94,59.69 180 top
R1  59.69,20.32 270 top
R2  41.91,36.83 270 top
R3  28.77,68.19 90 bottom
R4  27.56,54.01 270 bottom
R5  33.32,36.83 270 top
R6  37.64,36.77 270 top
R7  22.48,37.21 180 top
R8  25.78,33.4 270 top
R9  68.58,46.99 180 top
R10  71.12,34.29 180 top
R11  85.23,40.68 0 top
R12  85.09,44.45 0 top
R13  85.09,48.26 180 top
R14  24.13,21.59 270 top
R15  24.13,26.67 90 top
R16  34.29,25.4 90 top
R17  30.48,24.13 270 top
R18  34.29,15.37 270 top
R19  30.48,18.92 90 top
R20  40.64,66.04 270 top
R21  34.29,66.04 270 top
R22  27.94,66.04 270 top
R23  40.64,48.26 270 top
R24  34.29,48.26 270 top
R25  27.94,48.26 270 top
R26  31.9,53.99 270 bottom
S1  64.77,8.89 180 top
SV1  49.53,3.81 0 top
SV2  78.74,12.7 0 top
U1  59.69,63.5 0 top
U2  58.42,44.45 90 top
U3  49.53,12.7 0 top
U4  33.02,31.75 0 top
U5  76.2,43.18 0 top
U6  73.66,20.32 270 top
U$1  13.49,44.14 270 top
U$2  83.69,56.64 180 top
U$3  31.47,60.81 180 bottom
U$4  57.45,60.8 180 bottom

### Tracks (layer width: path | path; a pad name or v marks a point on that pad's centre or on a via)
+3V3  (via drill 0.35)
  Top 0.152: IC1.32 56.52,34.29 56.55,34.29
  Top 0.305: C14.1 47.05,22.52 IC1.1 46.26,24.73 45.05,25.94 IC1.64 | C25.2 77.37,52.57 U$2.4 | 54.61,27.94 54.82,27.73 IC1.19 60.56,27.73 C11.1 | 54.61,32 54.61,33.91 54.93,34.23 IC1.32 | 54.61,32 54.61,27.94 | IC1.13 53.05,26.38 54.61,27.94 | C10.1 49.18,21.27 49.6,21.25 v50.34,22 | 54.61,32 v52.83,30.23 51.44,31.62 49.02,31.62 47.05,33.59 IC1.48 47.05,36.9 46.35,37.59 44.83,37.59 v43.31,39.12 | JP5.1 36.83,43.18 35.94,42.29 35.94,39.62 v36.07,39.5
  Top 0.508: 56.55,34.29 56.55,35.47 60.73,39.65 U2.3 60.83,41.15 61.09,41.15 62.74,41.15 63.5,41.91 C5.1 65.63,42.14 v67.06,43.56 | 82.55,31.75 U6.VCC 83.47,28.29 C21.1 | 82.55,31.75 76.07,38.23 76.07,47.5 77.28,48.71 78.79,48.71 | C10.1 C14.1 C15.1 43.16,21.24 40.56,21.24 C7.1 | C7.1 C6.1 40.32,5.4 41.91,3.81 SV1.1 | C7.1 C8.1 C9.1 | C25.2 79.61,49.53 v77.85,49.53 | IC2.8 82.55,35.03 82.55,31.75
  Top 0.61: R13.2 81.67,48.26 C25.2 78.79,48.71 U5.14 | U6.VCC 86.36,25.4 86.36,16.51 SV2.4 | v58.42,44.45 58.42,44.03 61.09,41.36 61.09,41.15
  Bottom 0.305: v50.34,22 50.34,27.73 v52.83,30.23 | v36.07,39.5 42.93,39.5 v43.31,39.12 | C22.2 28.3,65.16 U$3.2
  Bottom 0.406: U$3.2 28.3,62.96 27.29,61.95 25.73,61.95 24.95,61.17 24.95,53.2 24.82,53.06 | 24.82,53.06 23.4,51.64 23.4,47.73 24.43,46.7 28.06,46.7 31.58,43.18 JP5.1 | 24.82,53.06 R4.2 31.88,53.06 R26.2
  Bottom 0.508: v77.85,49.53 72.64,49.53 | 72.64,49.53 67.06,43.94 v67.06,43.56 | v58.42,44.45 63.5,49.53 72.64,49.53
+5V  (via drill 0.35)  (2 unrouted)
  Top 0.305: C20.1 38.42,30.78 37.45,31.75 U4.8
  Top 0.61: v41.91,27.94 41.78,27.81 39.31,27.81 38.43,28.7 C20.1
  Top 0.813: C19.1 56.07,55.43 55.88,55.24
  Top 1.016: C19.1 59.89,55.56 | 56.14,55.51 55.88,55.24 C3.1 54.34,53.07 53.34,52.07 53.34,46.99 | U1.3 56.49,55.86 56.19,55.56 | 60.06,55.48 62.93,55.44 C4.1 | 53.34,46.99 53.34,43.18 55.27,41.25 U2.1 55.5,40.64 v52.07,40.64 | IC3.3 48.9,46.36 49.53,46.99 | 49.53,46.99 53.34,46.99 | 49.53,46.99 44.45,46.99 43.18,45.72 JP5.3
  Bottom 0.61: v41.91,27.94 41.91,33.48 49.16,40.73
  Bottom 1.016: v52.07,40.64 51.98,40.73 49.16,40.73 31.84,40.73 23.8,38.17 9.51,38.17 U$1.7
+12V
  Top 0.152: L1.2 21.59,67.31 27.62,67.31 R22.1
  Top 1.016: C2.1 54.45,63.77 54.45,65.5 54.76,65.81 U1.1 | C2.1 C1.1 49.8,60.47 48.26,58.93 D1.K | R22.1 R21.1 R20.1 44.77,66.99 47.99,63.77 C2.1
ADC1
  Top 0.305: R8.2 26.98,32.45 28.19,31.24 29.84,31.24 | 29.84,31.24 U4.4 | 29.84,31.24 29.23,31.86 JP1.1
  Top 0.508: C24.1 23.92,33.36 24.83,32.45 R8.2
ADC1_NF  (via drill 0.35)
  Top 0.406: JP1.2 26.68,44.44 25.4,45.72 22.31,45.72 19.27,42.68 19.27,36.07 v19.3,36.04
  Bottom 0.406: v19.3,36.04 17.4,34.14 U$1.8
ADC2
  Top 0.305: U4.5 29.49,30.76 | 29.49,30.76 26.6,27.87 C26.1 | JP2.1 21.33,27.89 24.74,30.76 29.49,30.76
  Top 0.508: R15.2 C26.1
ADC2_NF  (via drill 0.35)
  Top 0.406: v17.59,39.98 17.66,39.92 17.66,27.43 JP2.2 | v16.63,46.05 16.63,46.09 6.87,46.09 U$1.10
  Bottom 0.406: v16.63,46.05 17.59,45.08 v17.59,39.98
ADC3  (via drill 0.35)
  Top 0.305: U4.6 36.55,30.76 36.83,30.48 36.83,29.21 | JP3.1 38.23,11.68 36.83,13.08 36.83,29.21 | R17.2 30.8,22.86 v32.64,22.86 | v36.07,27.69 36.07,28.45 36.83,29.21
  Top 0.508: C27.1 31.12,21.33 30.48,21.97 R17.2
  Bottom 0.305: v32.64,22.86 36.07,26.29 v36.07,27.69
ADC3_NF
  Top 0.406: JP3.2 35.69,6.98 35.05,6.35 19.26,6.35 6.34,19.27 6.34,22.73 7.45,23.84 7.45,34.17 U$1.12
ADC4
  Top 0.305: JP4.1 26.67,23.37 28.7,25.4 | 28.7,25.4 28.7,26.8 33.15,31.24 U4.7 | R19.2 28.7,21.65 28.7,25.4
  Top 0.508: R19.2 31.25,19.87 32.24,18.88 C28.1
ADC4_NF
  Top 0.61: JP4.2 23.35,12.7 13.47,22.58 13.49,22.61 U$1.5
CAN_HIGH  (via drill 0.35)
  Top 0.508: v24.51,51.05 13.6,40.14 U$1.2
  Top 0.61: IC3.7 47.62,50.67 47.24,51.05 v44.07,51.05
  Bottom 0.61: v44.07,51.05 v24.51,51.05
CAN_LOW  (via drill 0.35)
  Top 0.508: v24.51,49.78 15.93,41.2 15.93,38.58 U$1.3
  Top 0.61: IC3.6 48.9,50.8 v48.64,51.05
  Bottom 0.61: v48.64,51.05 47.37,49.78 v24.51,49.78
CAN_RX
  Top 0.305: IC3.4 50.16,41.78 49.05,40.67 IC1.44
CAN_TX
  Top 0.305: IC3.1 46.35,42.93 48.55,40.73 IC1.45
CS  (via drill 0.35)
  Top 0.305: R11.2 88.9,40.68 88.9,48.26 R13.1 83.5,45.72 U5.13 77.47,45.72 77.09,45.34 v77.09,44.58 | v68.58,38.1 v60.96,38.1 | IC1.43 49.55,37.61 50.04,38.1 v50.8,38.1
  Bottom 0.305: v77.09,44.58 76.11,43.59 76.11,43.14 71.07,38.1 v68.58,38.1 | v60.96,38.1 v50.8,38.1
GND  (via drill 0.35)
  Top 0.508: C20.2 40.18,30.01 v39.37,30.81 | v40.39,36.32 40.39,37.47 40.7,37.78 R2.1
  Bottom 0.508: v39.37,30.81 39.37,32.36 40.39,33.38 v40.39,36.32
  pour Top: 0,72.39 95.25,72.39 95.25,0 0,0
  pour Bottom: 0,72.39 95.25,72.39 95.25,-0.01 0,-0.01
HOLD  (via drill 0.35)
  Top 0.305: IC2.7 86.62,37.3 v85.17,35.85 | v66.82,35.82 65.02,34.02 64.28,34.02 v61.94,36.36 v61.94,36.37 | v47,29.61 46.84,29.61 46.22,30.24 IC1.57
  Bottom 0.305: v85.17,35.85 66.85,35.85 v66.82,35.82 | v61.94,36.37 59.26,36.37 58.78,36.84 50.57,36.84 47.72,33.99 47.72,30.33 v47,29.61
MISO  (via drill 0.35)
  Top 0.305: U5.11 77.47,43.18 76.96,42.67 v76.96,41.4 | v59.18,31.11 59.18,29.72 58.67,29.21 56.57,29.21 IC1.22
  Bottom 0.305: v76.96,41.4 72.14,36.58 64.64,36.58 v59.18,31.11
MOSI  (via drill 0.35)
  Top 0.305: R9.2 v64.77,46.99 | v58.04,31.11 58.04,30.1 57.67,29.73 IC1.23
  Bottom 0.305: v64.77,46.99 62.99,45.21 62.99,36.45 58.04,31.5 v58.04,31.11
N$1
  Top 0.305: C13.1 46.97,39.77 47.55,39.19 IC1.47
N$2
  Top 0.152: IC1.31 56.52,33.66 IC1.31
  Top 0.305: C12.1 59.51,33.73 IC1.31
N$3
  Top 0.305: IC1.60 45.01,28.77 44.32,28.77 41.91,31.19 R2.2
N$4
  Top 0.305: R1.1 58.78,22.18 58.52,22.18 57.33,23.37 50.08,23.37 49.55,23.9 IC1.6
N$5
  Top 0.305: C17.1 57.7,19.37 58.36,19.37
  Top 0.508: U3.2 57.15,15.57 57.15,18.16 58.36,19.37 R1.2
N$6
  Top 0.305: IC1.5 49.05,23.47 49.66,22.86 52.7,22.86 53.47,22.09 C18.1
  Top 0.508: U3.1 48.72,16.64 51.69,16.64 52.07,17.02 52.07,20.83 52.41,21.17 C18.1
N$7
  Top 0.305: U5.2 70.8,45.72 R9.1
N$8
  Bottom 0.508: U$4.VBAT 30.22,60.8 29.57,60.15 U$3.14
N$9  (via drill 0.35)
  Top 0.305: U5.8 80.06,38.1 v81.28,38.1 | v76.2,58.42 75.17,57.39 U$2.2
  Bottom 0.305: v76.2,58.42 81.28,53.34 v81.28,38.1
N$11
  Top 0.305: U5.3 74.68,44.45 75.06,44.83 75.06,53.47 76.27,54.68 U$2.3
N$12  (via drill 0.35)
  Top 0.305: v78.49,52.7 78.47,52.72 U$2.5 | v75.18,43.18 75.18,41.02 74.8,40.64 U5.6 | v78.11,50.67 77.98,50.67 v75.95,48.64
  Bottom 0.305: v75.18,43.18 75.18,43.94 75.95,44.7 v75.95,48.64 | v78.11,50.67 78.49,51.05 v78.49,52.7
N$13
  Top 0.305: R12.1 U5.12
N$14
  Top 0.305: R10.1 72.07,41.59 72.39,41.91 U5.5
N$15
  Top 0.305: R11.1 78.83,40.68 U5.9
N$16  (via drill 0.35)
  Top 0.305: R12.2 v87.63,44.45 | v85.09,50.8 80.77,55.12 80.77,56.31 U$2.7
  Bottom 0.305: v87.63,44.45 85.09,46.99 v85.09,50.8
N$17
  Top 0.508: R8.1 25.78,36.7 25.27,37.21 R7.1 23.43,39.69 24.14,40.4 JP1.3
N$18
  Top 0.508: R14.1 R15.1 23.5,25.72 20.53,22.75 20.46,22.81 JP2.3
N$19
  Top 0.508: R17.1 31.94,25.08 32.57,24.45 R16.1 35.37,24.45 36.2,23.62
  Top 0.61: 36.2,23.62 36.2,13.33 35.56,12.7 34.16,12.7 33.15,11.68 JP3.3
N$20
  Top 0.508: R18.1 30.8,16.32 30.54,16.57 | 30.54,16.57 30.48,16.64 R19.1 | JP4.3 29.21,10.16 30.54,11.49 30.54,16.57
N$21
  Top 1.016: JP5.2 40.64,41.91 37.64,38.91 R6.1 33.38,37.72 R5.1
N$22
  Top 0.254: P2.1 35.77,63.61 R21.2
N$23
  Top 0.254: P1.1 42.12,63.61 R20.2
N$24
  Top 0.254: P3.1 29.41,63.61 R22.2
N$25
  Bottom 0.305: R3.1 29.57,66.45 U$3.3
N$28
  Top 0.254: K1.1 40.64,51.5 R23.1
N$29
  Top 0.254: K2.1 34.29,51.5 R24.1
N$30
  Top 0.254: R25.1 27.94,51.5 K3.1
N$31
  Top 0.254: K1.3 39.16,53.93 P1.2
N$32
  Top 0.254: K2.3 32.81,53.93 P2.2
N$33
  Top 0.254: K3.3 26.46,53.93 P3.2
PB8  (via drill 0.35)
  Top 0.305: R5.2 35.18,34.02 35.18,32.77 U4.10 36.55,32.74 36.83,33.02 v36.83,34.29 | IC1.61 44.03,28.23 40.13,32.13 40.13,33.91 39.75,34.29 v39.37,34.29
  Bottom 0.305: v39.37,34.29 v36.83,34.29
PB9
  Top 0.305: U4.9 36.83,32.26 37.65,33.07 37.79,33.22 37.99,33.42 | IC1.62 43.67,27.73 37.99,33.42 | R6.2 37.99,35.47 37.99,33.42
PB10  (via drill 0.35)
  Top 0.305: U6.SCL 77.34,29.34 77.34,31.5 76.83,32 v75.82,32 | v72.52,32 v67.69,32 | v61.85,32.13 59.05,32.13 58.46,32.73 IC1.29
  Bottom 0.305: v75.82,32 v72.52,32 | v67.69,32 61.98,32 v61.85,32.13
PB11  (via drill 0.35)
  Top 0.305: U6.SDA 74.93,31.5 73.66,32.77 v66.8,32.77 | v63.12,33.27 63.08,33.23 IC1.30
  Bottom 0.305: v66.8,32.77 66.29,32.77 65.79,33.27 v63.12,33.27
PC6  (via drill 0.35)
  Top 0.305: R23.2 42.48,47.31 v42.55,47.24 | v55.88,39.37 55.63,39.37 54.83,38.58 54.2,38.58 52.55,36.93 IC1.37
  Bottom 0.305: v42.55,47.24 43.69,47.24 44.88,46.05 53.77,46.05 55.88,43.94 v55.88,39.37
PC7  (via drill 0.35)
  Top 0.305: R24.2 37.4,47.31 v37.47,47.24 | v54.61,39.5 54.23,39.12 53.85,39.12 52.05,37.32 IC1.38
  Bottom 0.305: v37.47,47.24 39.12,45.59 53.58,45.59 55.24,43.94 55.24,40.13 v54.61,39.5
PC8  (via drill 0.35)
  Top 0.305: v30.61,47.37 30.55,47.31 R25.2 | v53.21,39.6 51.55,37.94 IC1.39
  Bottom 0.305: v30.61,47.37 32.84,45.14 53.29,45.14 54.48,43.94 54.48,40.87 v53.21,39.6
PC12  (via drill 0.35)
  Top 0.305: SV2.3 80.01,14.6 68.99,25.63 61.45,25.63 v61.42,25.66 | v53.09,27.69 49.91,30.86 48.53,30.86 47.2,32.19 45.09,32.19 IC1.53
  Bottom 0.305: v61.42,25.66 v61.41,25.67 55.1,25.67 v53.09,27.69
PD2  (via drill 0.35)
  Top 0.305: SV2.2 77.47,14.73 67.72,24.48 v61.43,24.48 | v52.07,26.67 47.01,31.73 IC1.54
  Bottom 0.305: v61.43,24.48 54.26,24.48 v52.07,26.67
RTC_SCL  (via drill 0.35)
  Top 0.305: v49.98,33.73 50.36,34.1 50.36,34.92 50.55,35.11 IC1.41 | v44.8,35.2 43.48,36.52 v43.48,36.55 | v30.86,37.56 30.86,46.65 31.29,47.09 31.29,52.67 v29.94,54.02
  Bottom 0.305: v49.98,33.73 49.91,33.66 49.36,33.66 49.05,33.34 49.05,32.3 49.08,32.27 49.08,29.4 47.24,27.56 46.52,27.56 44.65,29.43 44.65,35.04 v44.8,35.2 | v43.48,36.55 42.47,37.56 v30.86,37.56
  Bottom 0.406: U$3.16 27.03,55.83 27.56,55.3 R4.1 29,54.96 v29.94,54.02
RTC_SDA  (via drill 0.35)
  Top 0.305: IC1.40 v51.05,34.65 v51.04,34.64 | v45.61,35.96 44.39,37.17 v44.2,37.17 | v31.85,38.46 31.85,54.55 v30.28,56.12
  Bottom 0.305: v51.04,34.64 50.91,34.51 49.13,34.51 48.3,33.68 48.3,29.59 47.14,28.43 46.65,28.43 45.61,29.47 v45.61,35.96 | v44.2,37.17 42.91,38.46 v31.85,38.46 | v30.28,56.12 30.71,56.12 R26.1
  Bottom 0.406: R26.1 30.17,54.94 28.3,56.81 U$3.15
SCK
  Top 0.305: IC1.21 60.48,28.73 66.04,34.29 R10.2
SPI2_MISO  (via drill 0.35)
  Top 0.305: IC2.2 86.62,30.63 v86.66,30.59 | v53.83,33.91 53.83,34.55 53.53,34.85 53.53,36.21 IC1.35
  Bottom 0.305: v86.66,30.59 86.66,27.67 85.41,26.42 63.64,26.42 62.42,27.64 58.59,27.64 53.83,32.4 v53.83,33.91
SPI2_MOSI  (via drill 0.35)
  Top 0.305: IC2.5 89.16,36.43 v88.79,36.06 | v53.08,33.11 53.08,36.2 IC1.36
  Bottom 0.305: v88.79,36.06 87.78,35.04 87.78,27.63 85.93,25.79 63.23,25.79 62.38,26.63 58.47,26.63 53.08,32.02 v53.08,33.11
SPI2_SCK  (via drill 0.35)
  Top 0.305: IC2.6 87.89,36.95 v86.96,36.02 | IC1.34 54.05,36.91 54.55,37.41 55.63,37.41 55.69,37.34 v55.69,36.16
  Bottom 0.305: v86.96,36.02 86.96,32.11 85.27,30.42 85.27,27.75 84.64,27.13 63.99,27.13 62.65,28.47 62.65,28.62 62.45,28.81 58.7,28.81 55.14,32.37 55.14,34.95 55.69,35.5 v55.69,36.16
SYS_NRST  (via drill 0.35)
  Top 0.305: IC1.7 50.09,24.68 50.09,24 50.27,23.82 58.47,23.82 58.8,23.49 v58.8,22.86 | v58.8,17.4 58.8,15.25 C16.1
  Top 0.813: S1.4 56.99,10.89 54.61,8.51 SV1.5 | S1.4 S1.3 | C16.1 58.81,13.57 60.32,12.07 S1.4
  Bottom 0.305: v58.8,22.86 v58.8,17.4
SYS_SWCLK  (via drill 0.35)
  Top 0.305: IC1.49 45.01,34.19 44.32,34.19 43.18,33.04 v43.18,31.75 | v43.18,17.78 41.15,15.75 41.15,7.37 42.04,6.48 45.85,6.48 46.99,5.33 SV1.2 | v43.18,26.67 v43.18,22.86
  Bottom 0.305: v43.18,31.75 v43.18,26.67 | v43.18,22.86 v43.18,17.78
SYS_SWDIO  (via drill 0.35)
  Top 0.305: SV1.4 49.53,6.35 v49.53,15.24 | v49.73,32.58 48.05,34.27 IC1.46
  Bottom 0.305: v49.53,15.24 49.64,15.35 49.64,32.49 v49.73,32.58
V_IN
  Top 1.016: L1.1 D2.C 5.73,59.2 2.29,55.75 2.29,35.37 5.49,32.17 U$1.13
W  (via drill 0.35)
  Top 0.305: IC2.3 87.89,33.3 86.33,34.87 v83.97,34.87 | v64.56,34.88 64.48,34.88 v62.06,37.31 | v46.93,30.73 IC1.56
  Bottom 0.305: v83.97,34.87 64.57,34.87 v64.56,34.88 | v46.93,30.73 46.93,33.92 50.31,37.31 v62.06,37.31

### Text on the board
tNames: X:/10 - Seasons/07 - Season 2019/10 - Car Design/05 - Electronics/02 - PCB Design/Rub Motorsport Logo 2014 black.bmp | RUB20-Datalogger-v0.1